# Altium project MOTOR_DRIVE_EVAL.PrjPCB (part 1 of 2)
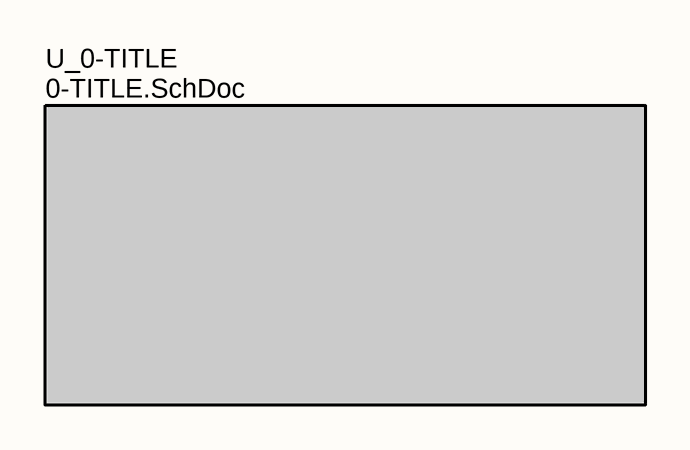
[diagram p0: 1-MAIN.SchDoc]
14 sheets, 148 parts. Net scope: flat (ports and power ports of the same name join across sheets).
Board file: MD_EVAL_BRD.PcbDoc
Sheets:
  1-MAIN.SchDoc
    U_0-TITLE = 0-TITLE.SchDoc
  2-BUCK_3V3_MCU.SchDoc
  3-MCU.SchDoc
  4-JTAG.SchDoc
  5-CAN_TRANSCEIVER.SchDoc
  6-INTERCONNECT_MAP.SchDoc
  7-PWM_INTERLOCK.SchDoc
  8-DRV_LDO_6V.SchDoc
  9-SIGNAL_CONDITIONING.SchDoc
  10-BUS_SENS.SchDoc
  11-HALF_BRIDGE.SchDoc
  12-TEMPERATURE.SchDoc
  13-MECHANICALS.SchDoc

## Sheet 1-MAIN.SchDoc: MAIN
size A0; Author: Alexandre Cosneau; CompanyName: Tristar Multicopters; DrawnBy: Alexandre Cosneau; Engineer: Alexandre Cosneau; Organization: Tristar Multicopters; Address1: Genie / GEGI; Address2: 2500 boulevard de l'universite; Address3: J1K2R SHERBROOKE; Address4: QUEBEC, CANADA; DocumentNumber: 2; Revision: 1.0; SheetNumber: 2; SheetTotal: 15

### Sub-sheets
U_0-TITLE = 0-TITLE.SchDoc: no entries

### Notes on the sheet
- Title
- Size:
- Date:
- File:
- A0
- Number:
- Time:
- Revision:
- Sheet
- of

## Sheet 0-TITLE.SchDoc: ESC GaN V1
size B; Author: Alexandre Cosneau; CompanyName: Tristar Multicopters; DrawnBy: Alexandre Cosneau; Organization: Tristar Multicopters; Address1: Genie / GEGI; Address2: 2500 boulevard de l'universite; Address3: J1K2R SHERBROOKE; Address4: QUEBEC, CANADA; DocumentNumber: 1; Revision: 1.0; SheetNumber: 1; SheetTotal: 15

### Notes on the sheet
- REV
- COMMENT
- REVISION HISTORY
- DATE
- Title:
- Size:
- Date:
- A
- Revision:
- Time:
- Author:
- Sheet
- of
- File:

## Sheet 2-BUCK_3V3_MCU.SchDoc: BUCK 3V3 MCU
size A4; Author: Alexandre Cosneau; CompanyName: Tristar; Organization: Tristar; Address1: Suite J-1270; Address2: 400 Rue Montfort; Address3: H3C4J9, MONTREAL; Address4: QUEBEC, CANADA
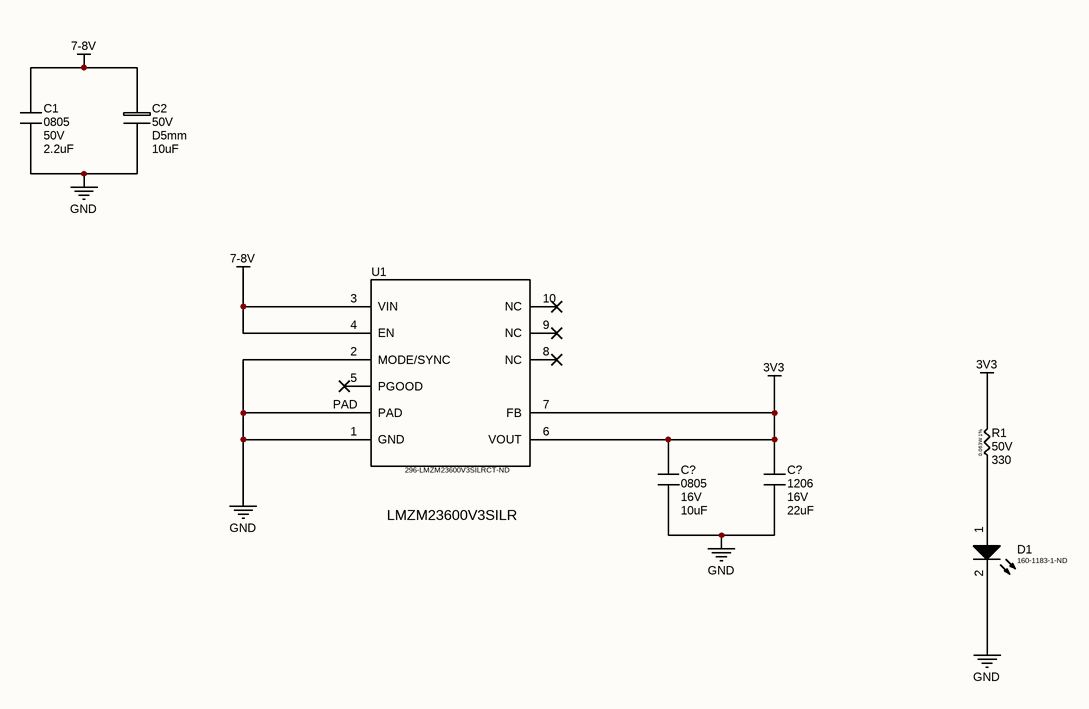
[diagram p1: 2-BUCK_3V3_MCU.SchDoc]

### Parts
(Parts that share a designator on the sheet are numbered #1, #2 ... from top to bottom, then left to right.)
C1#1  Package: 0805  VDC: 50V  [C 0805(2012)x0.65]  (hidden comment: 2.2uF)
C2#1  VDC: 50V  Package: D5mm  [EL SMD D5 h5.4]  (hidden comment: 10uF)
C?#1  Package: 0805  VDC: 16V  [C 0805(2012)x0.65]  (hidden comment: 10uF)
C?#2  Package: 1206  VDC: 16V  [C 1206(3216)x1.6]  (hidden comment: 22uF)
D1#1  Supplier Part Number 1: 160-1183-1-ND  [LED 0603]  (hidden comment: LED 0603)
R1#1  VDC: 50V  [R 0402(1005)-1%]  (hidden comment: 330)
U1#1  Supplier Part Number 1: 296-LMZM23600V3SILRCT-ND  [MICROSIP-10]  (hidden comment: MICROSIP)

### Nets
3V3: C?#1.1 C?#2.1 R1#1.2 U1#1.6(VOUT) U1#1.7(FB)
7-8V: C1#1.1 C2#1.1 U1#1.3(VIN) U1#1.4(EN)
GND: C1#1.2 C2#1.2 C?#1.2 C?#2.2 D1#1.2 U1#1.1(GND) U1#1.2(MODE/SYNC) U1#1.PAD
NetD1#1_1: D1#1.1 R1#1.1

Not connected (* = marked no-connect by the designer): U1#1 5(PGOOD)* 8(NC)* 9(NC)* 10(NC)*

### Notes on the sheet
- LMZM23600V3SILR
- Title:
- Size:
- Date:
- A
- Revision:
- Time:
- Author:
- Sheet
- of
- File:
- (in symbol RES 0402-1%) 0.063W 1%

### Library data of the parts
C1#1 C?#1 = CAP 0805 2.2nF 50V X7R: SMD-0805 50V X7R 10%; Part Number: CL21B222KBNC; Manufacturer: Samsung; TYPE: Capacitors; Package-mm: 2012; Mount Type: SMT; Publisher: Hefest; Manufacturer Alternate: *; Part Number Alternate: *; Published: 07.04.2019; Supplier 1: Comet; Supplier 2: *; Supplier 3: *; Supplier Part Number 1: C0805 2.2nF 50V X7R SAMSUNG; Supplier Part Number 2: *; Supplier Part Number 3: *; RoHS: Y; Technology: Ceramic  MLCC; Value 1: *; Value 2: *; TempCo: X7R; Tolerance %: ±10%; VAC: *; ESR Ohm: *; ComponentLink1Description: Datasheet link; ComponentLink1URL: https://store.comet.bg/download-file.php?id=11; Temperature Range: -55°C ~ +125°C; Price: 0.026
  C1#1: Value: 2.2uF
  C?#1: Value: 10uF
C2#1 = EL 10uF 50V +105°C: SMD D5mm h5.4mm; Part Number: CK1H100M-CRE54; Manufacturer: Fujicon; Tolerance %: ±20%; TYPE: Capacitors; Load life: 2000h @ +105°C; Mount Type: SMT; Publisher: Hefest; Manufacturer Alternate: *; Part Number Alternate: *; Published: 07.04.2019; Supplier 1: Comet; Supplier 2: *; Supplier 3: *; Supplier Part Number 1: CE 10uF 50V SMD 105C Fujicon; Supplier Part Number 2: *; Supplier Part Number 3: *; RoHS: Y; Technology: Electrolytic Aluminum; Value 1: *; Value 2: *; TempCo: *; VAC: *; ESR Ohm: *; ComponentLink1Description: Datasheet link; ComponentLink1URL: https://store.comet.bg/download-file.php?id=10100; Temperature Range: -40°C ~ +105°C; Price: 0.106; Value: 10uF
C?#2 = CAP 1206 4.7uF 50V X7R: SMD-1206 50V X7R 10%; Part Number: CL31B475KBHNNNE; Manufacturer: Samsung; TYPE: Capacitors; Package-mm: 3216; Mount Type: SMT; Publisher: Hefest; Manufacturer Alternate: *; Part Number Alternate: *; Published: 07.04.2019; Supplier 1: Comet; Supplier 2: *; Supplier 3: *; Supplier Part Number 1: C1206 4.7uF 50V X7R SAMSUNG; Supplier Part Number 2: *; Supplier Part Number 3: *; RoHS: Y; Technology: Ceramic  MLCC; Value 1: *; Value 2: *; TempCo: X7R; Tolerance %: ±10%; VAC: *; ESR Ohm: *; ComponentLink1Description: Datasheet link; ComponentLink1URL: https://store.comet.bg/download-file.php?id=11; Temperature Range: -55°C ~ +125°C; Price: 0.290; Value: 22uF
D1#1 = LED 0603: LED SMD 0603; Supplier 1: Digi-Key; PACKAGE: 0603; TYPE: LED
R1#1 = RES 0402-1%: SMD 0402 0.063W 1% 50V; Manufacturer: YAGEO; TempCo: ±100ppm/°C; Package-mm: 1005; Value Code: 1001; Power: 0.0625W; Part Number: *; Mount Type: SMT; Publisher: Hefest; Manufacturer Alternate: *; Published: 07.04.2019; Supplier 1: Comet; Supplier 2: *; Supplier 3: *; Supplier Part Number 1: R0402 1.0K 1% YAG/ASJ; Supplier Part Number 2: *; Supplier Part Number 3: *; RoHS: Y; Technology: Thick film; Value 2: *; Package: 0402; Tolerance %: ±1%; ComponentLink1Description: Datasheet link; ComponentLink1URL: https://store.comet.bg/download-file.php?id=1224; Temperature Range: -55°C ~ +155°C; Price: 0.015; Part Number Alternate: *; TYPE: Resistor; Value 1: *; Value: 330
U1#1 = LMZM23600: V3 DCDC 3V3 500mA; Supplier 1: Digi-Key; PACKAGE: MICROSIP; TYPE: BUCK

## Sheet 3-MCU.SchDoc: MCU
size A1; CompanyName: TRISTAR; Organization: Sherbrooke's University; Address1: Genie / GEGI; Address2: 2500 boulevard de l'universite; Address3: J1K2R SHERBROOKE; Address4: QUEBEC, CANADA
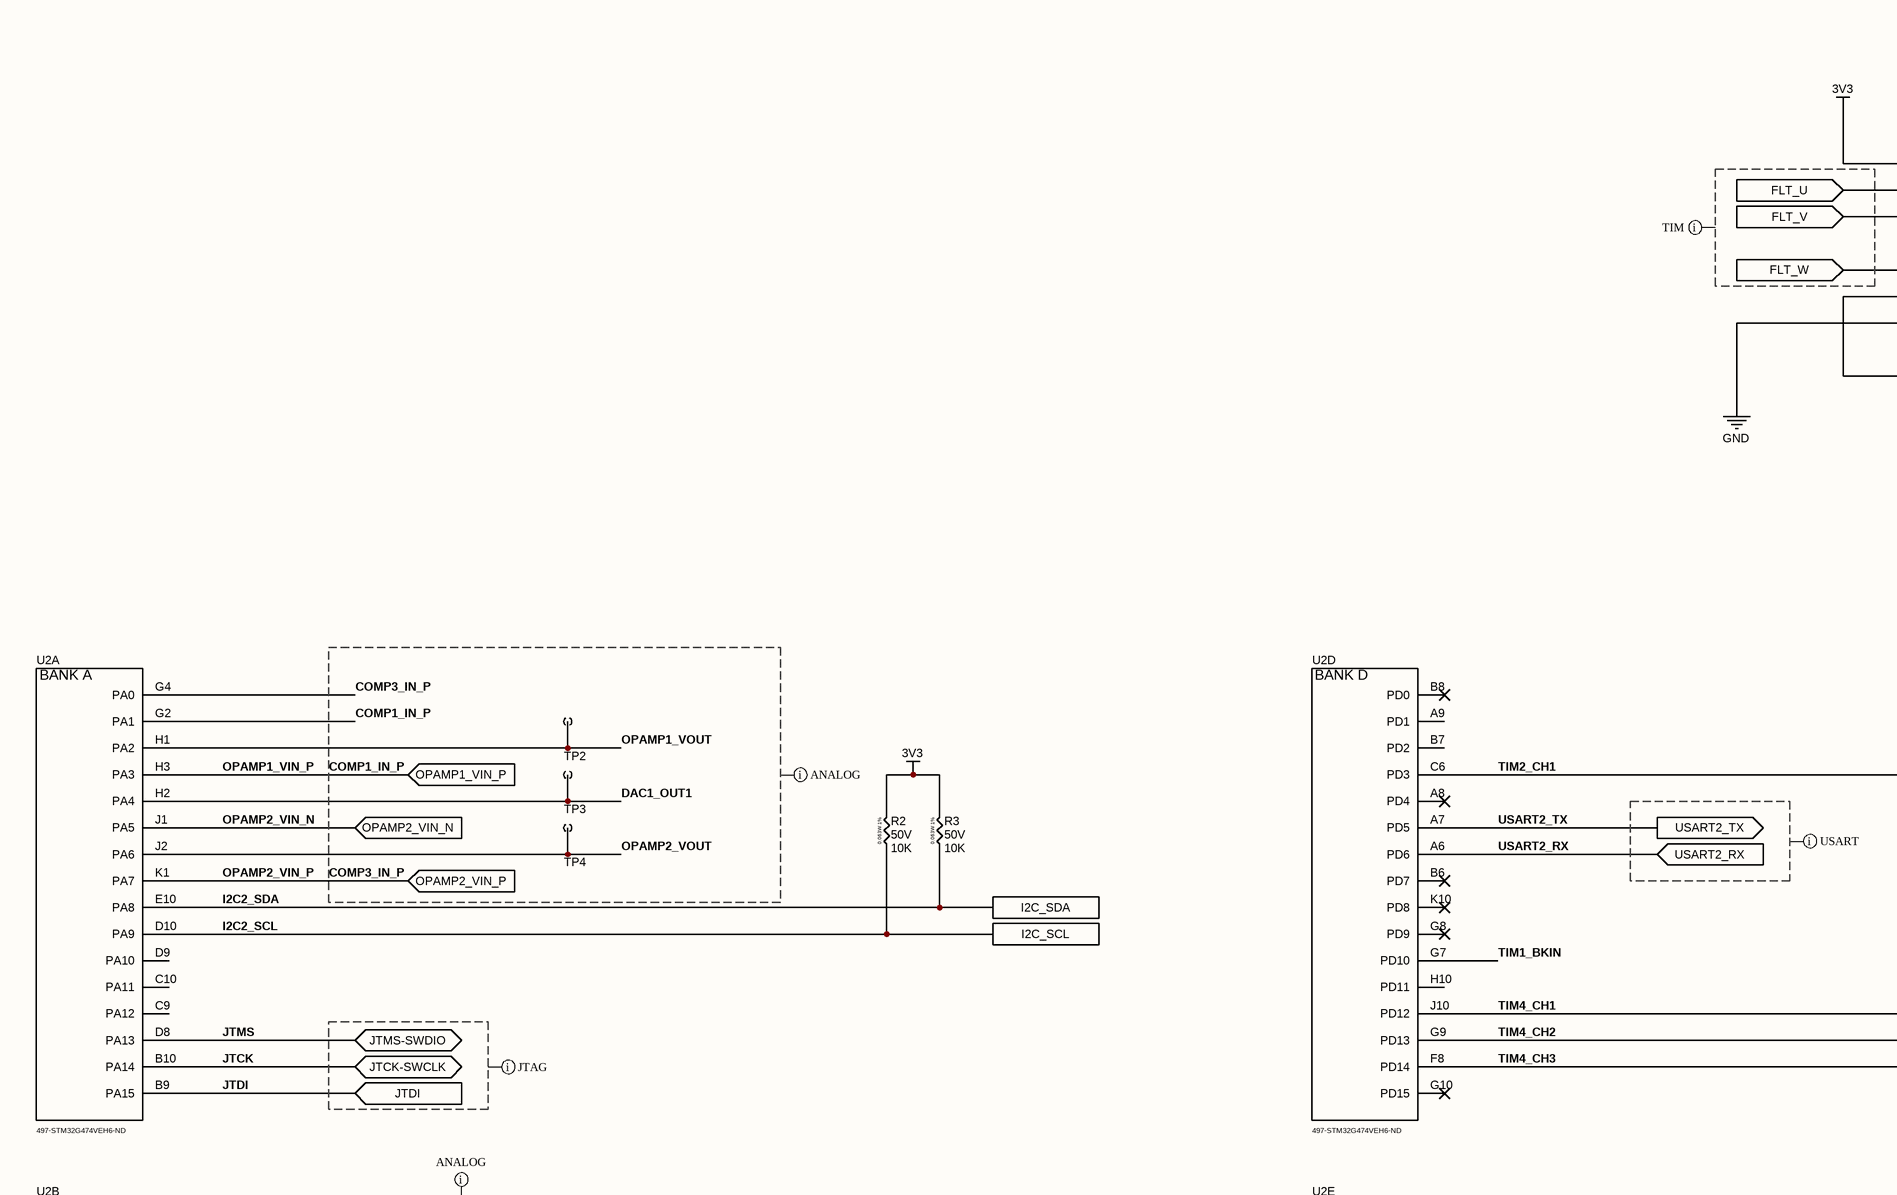
[diagram p2: 3-MCU.SchDoc, top left]
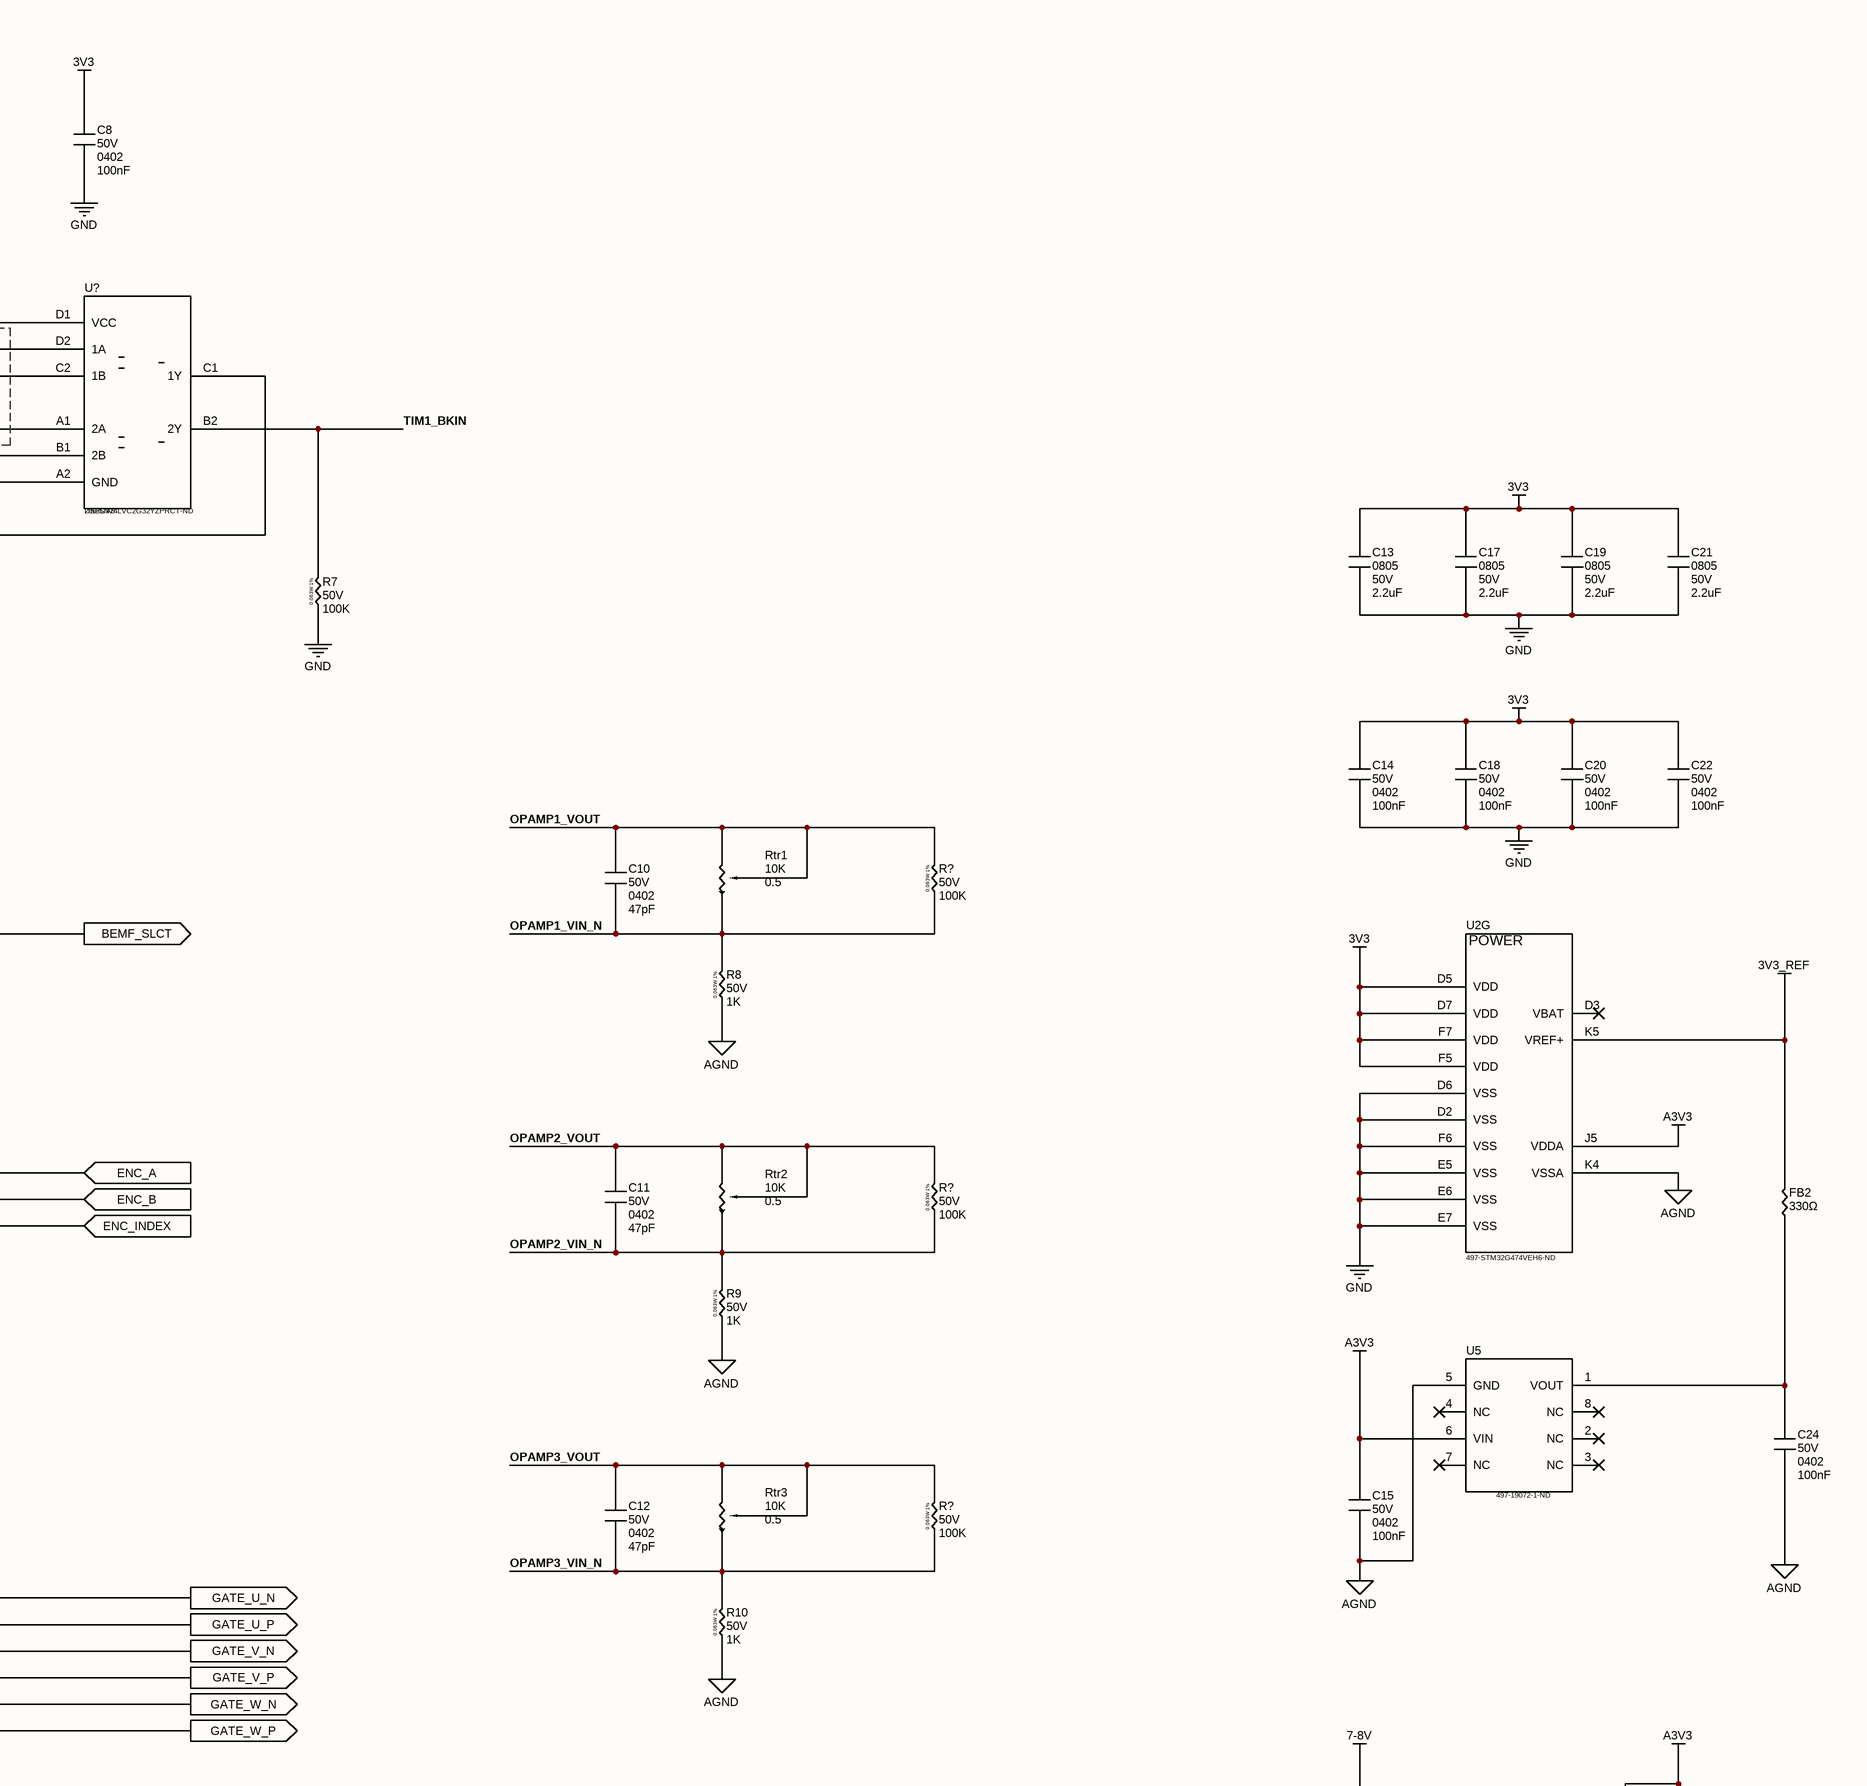
[diagram p3: 3-MCU.SchDoc, top right]
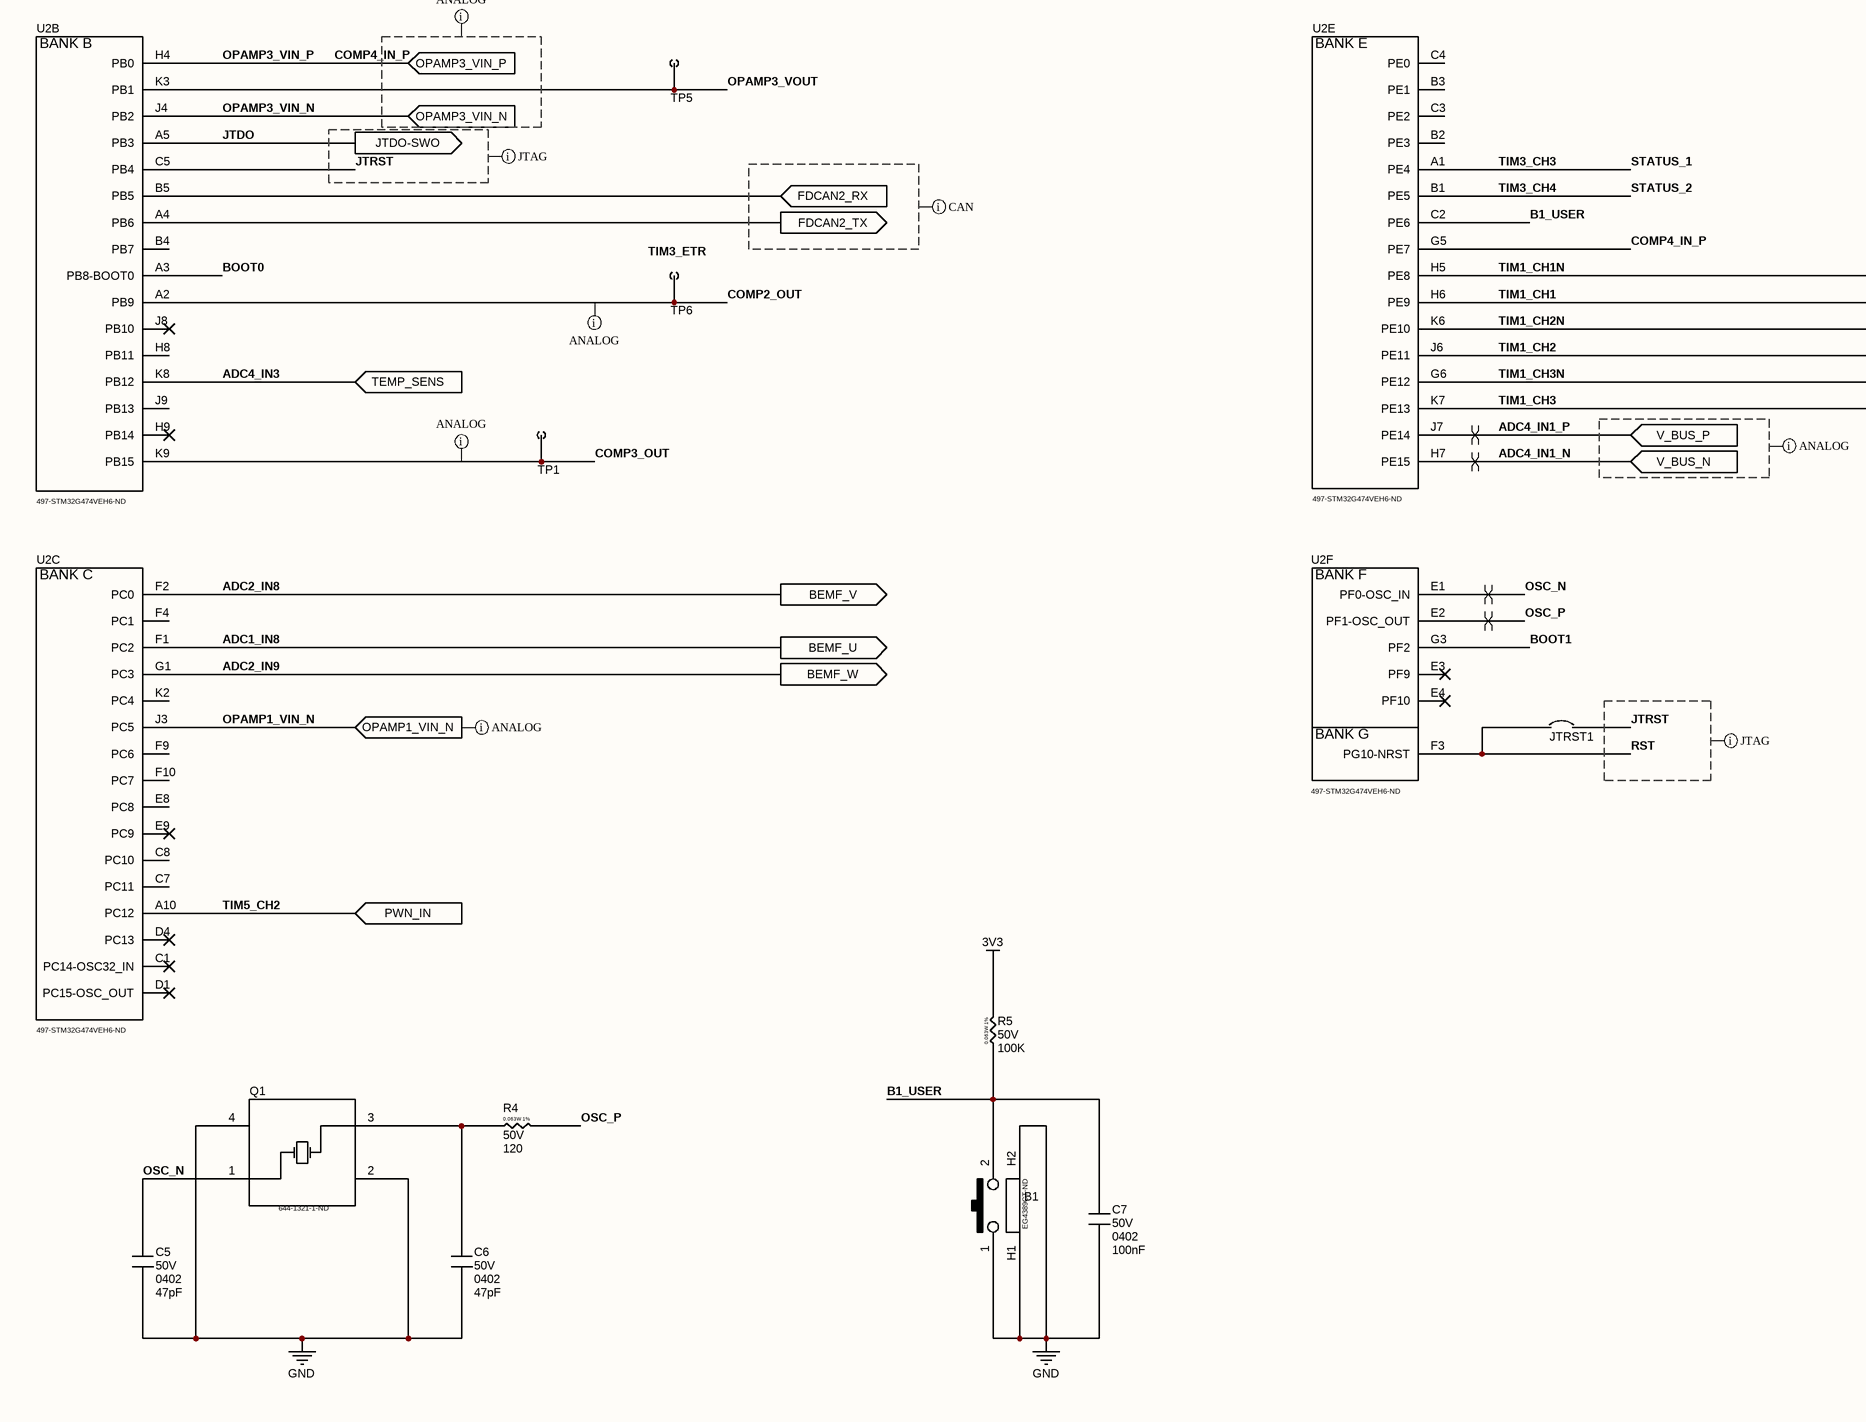
[diagram p4: 3-MCU.SchDoc, bottom left]
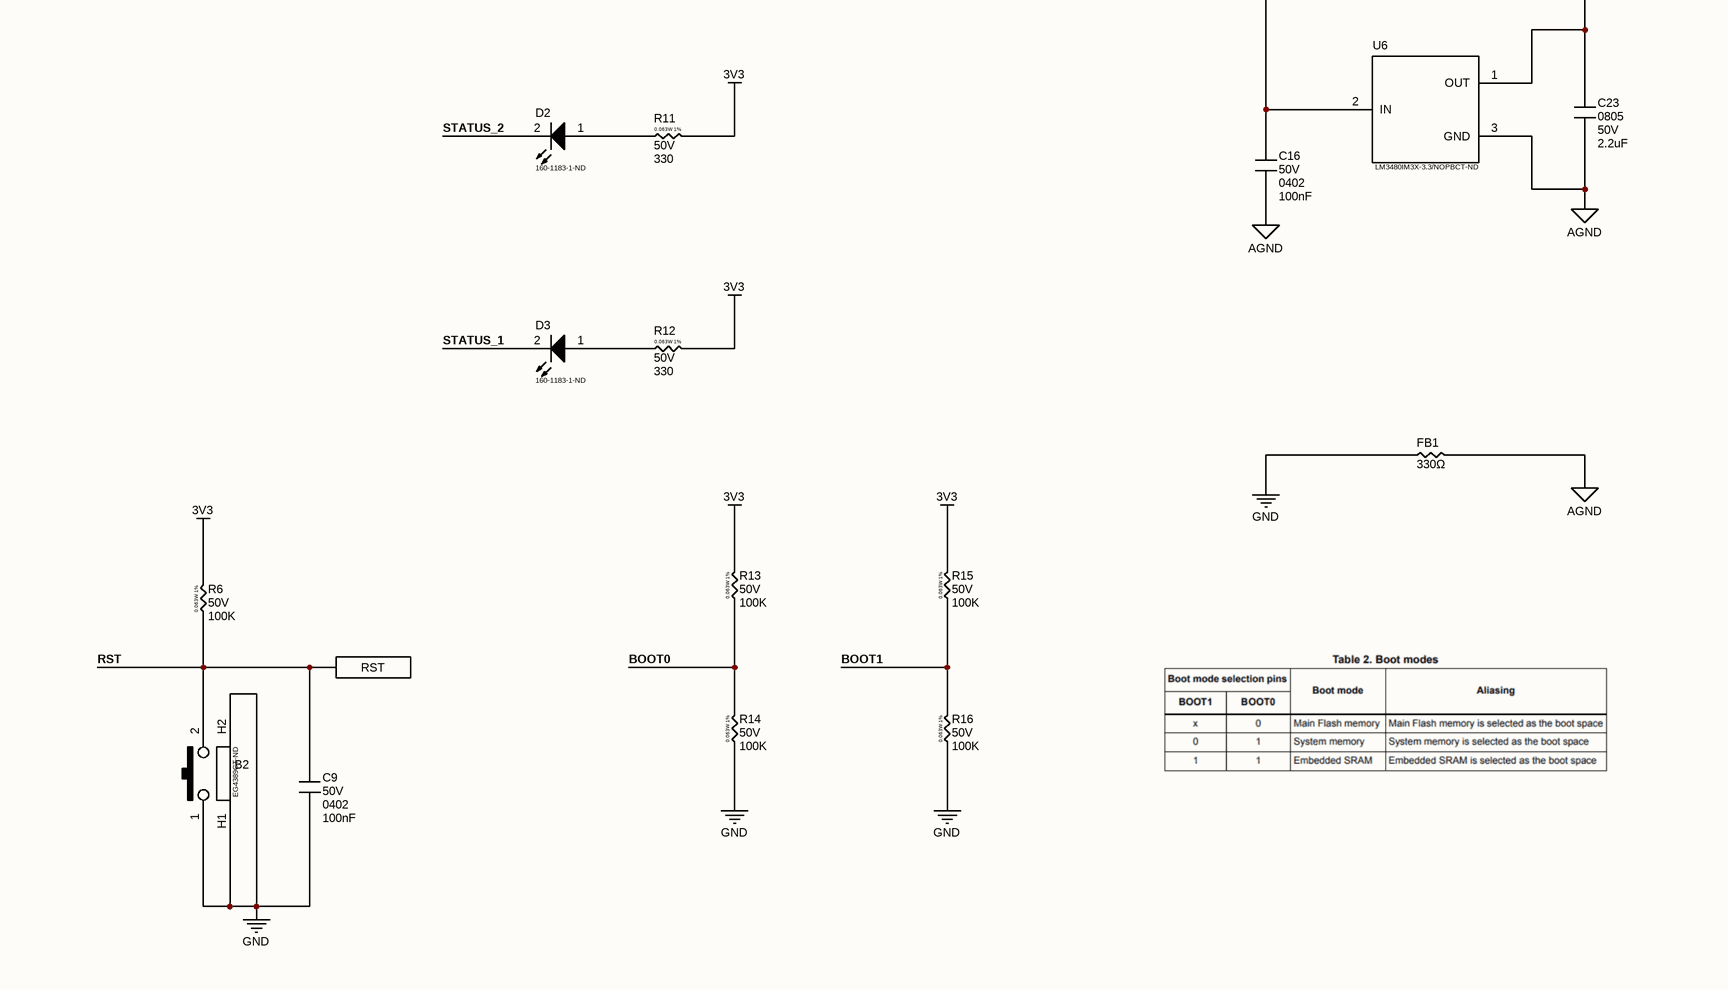
[diagram p5: 3-MCU.SchDoc, bottom right]

### Parts
(Parts that share a designator on the sheet are numbered #1, #2 ... from top to bottom, then left to right.)
B1  Supplier Part Number 1: EG4389CT-ND  [BUTTON_SINGLE_SIDE]  (hidden comment: PUSH BUTT SINGLE SIDE)
B2  Supplier Part Number 1: EG4389CT-ND  [BUTTON_SINGLE_SIDE]  (hidden comment: PUSH BUTT SINGLE SIDE)
C5  VDC: 50V  Package: 0402  [C 0402(1005)x0.5]  (hidden comment: 47pF)
C6  VDC: 50V  Package: 0402  [C 0402(1005)x0.5]  (hidden comment: 47pF)
C7  VDC: 50V  Package: 0402  [C 0402(1005)x0.5]  (hidden comment: 100nF)
C8  VDC: 50V  Package: 0402  [C 0402(1005)x0.5]  (hidden comment: 100nF)
C9  VDC: 50V  Package: 0402  [C 0402(1005)x0.5]  (hidden comment: 100nF)
C10  VDC: 50V  Package: 0402  [C 0402(1005)x0.5]  (hidden comment: 47pF)
C11#1  VDC: 50V  Package: 0402  [C 0402(1005)x0.5]  (hidden comment: 47pF)
C12#1  VDC: 50V  Package: 0402  [C 0402(1005)x0.5]  (hidden comment: 47pF)
C13#1  Package: 0805  VDC: 50V  [C 0805(2012)x0.65]  (hidden comment: 2.2uF)
C14#1  VDC: 50V  Package: 0402  [C 0402(1005)x0.5]  (hidden comment: 100nF)
C15#1  VDC: 50V  Package: 0402  [C 0402(1005)x0.5]  (hidden comment: 100nF)
C16#1  VDC: 50V  Package: 0402  [C 0402(1005)x0.5]  (hidden comment: 100nF)
C17#1  Package: 0805  VDC: 50V  [C 0805(2012)x0.65]  (hidden comment: 2.2uF)
C18#1  VDC: 50V  Package: 0402  [C 0402(1005)x0.5]  (hidden comment: 100nF)
C19  Package: 0805  VDC: 50V  [C 0805(2012)x0.65]  (hidden comment: 2.2uF)
C20  VDC: 50V  Package: 0402  [C 0402(1005)x0.5]  (hidden comment: 100nF)
C21  Package: 0805  VDC: 50V  [C 0805(2012)x0.65]  (hidden comment: 2.2uF)
C22  VDC: 50V  Package: 0402  [C 0402(1005)x0.5]  (hidden comment: 100nF)
C23#1  Package: 0805  VDC: 50V  [C 0805(2012)x0.65]  (hidden comment: 2.2uF)
C24  VDC: 50V  Package: 0402  [C 0402(1005)x0.5]  (hidden comment: 100nF)
D2#1  Supplier Part Number 1: 160-1183-1-ND  [LED 0603]  (hidden comment: LED 0603)
D3#1  Supplier Part Number 1: 160-1183-1-ND  [LED 0603]  (hidden comment: LED 0603)
FB1  ZTyp@100MHz: 330Ω  [FB 0805(2012)]  (hidden comment: 0.525u)
FB2  ZTyp@100MHz: 330Ω  [FB 0805(2012)]  (hidden comment: 0.525u)
JTRST1  SHORT_PARALLEL  [SHORT_PARALLEL]  (value not drawn)  (net tie, no BOM)
Q1#1  Supplier Part Number 1: 644-1321-1-ND  [QUARTZ_1]  (hidden comment: OSC NX2016)
R2#1  VDC: 50V  [R 0402(1005)-1%]  (hidden comment: 10K)
R3#1  VDC: 50V  [R 0402(1005)-1%]  (hidden comment: 10K)
R4#1  VDC: 50V  [R 0402(1005)-1%]  (hidden comment: 120)
R5  VDC: 50V  [R 0402(1005)-1%]  (hidden comment: 100K)
R6  VDC: 50V  [R 0402(1005)-1%]  (hidden comment: 100K)
R7  VDC: 50V  [R 0402(1005)-1%]  (hidden comment: 100K)
R8  VDC: 50V  [R 0402(1005)-1%]  (hidden comment: 1K)
R9  VDC: 50V  [R 0402(1005)-1%]  (hidden comment: 1K)
R10  VDC: 50V  [R 0402(1005)-1%]  (hidden comment: 1K)
R11#1  VDC: 50V  [R 0402(1005)-1%]  (hidden comment: 330)
R12#1  VDC: 50V  [R 0402(1005)-1%]  (hidden comment: 330)
R13#1  VDC: 50V  [R 0402(1005)-1%]  (hidden comment: 100K)
R14#1  VDC: 50V  [R 0402(1005)-1%]  (hidden comment: 100K)
R15#1  VDC: 50V  [R 0402(1005)-1%]  (hidden comment: 100K)
R16#1  VDC: 50V  [R 0402(1005)-1%]  (hidden comment: 100K)
R?#1  VDC: 50V  [R 0402(1005)-1%]  (hidden comment: 100K)
R?#2  VDC: 50V  [R 0402(1005)-1%]  (hidden comment: 100K)
R?#3  VDC: 50V  [R 0402(1005)-1%]  (hidden comment: 100K)
Rtr1  Set Position: 0.5  [Rtr SMD3]  (hidden comment: 10K)
Rtr2  Set Position: 0.5  [Rtr SMD3]  (hidden comment: 10K)
Rtr3  Set Position: 0.5  [Rtr SMD3]  (hidden comment: 10K)
TP1  TP ROUND  [TP_ROUND]  (value not drawn)  (no BOM)
TP2  TP ROUND  [TP_ROUND]  (value not drawn)  (no BOM)
TP3  TP ROUND  [TP_ROUND]  (value not drawn)  (no BOM)
TP4  TP ROUND  [TP_ROUND]  (value not drawn)  (no BOM)
TP5  TP ROUND  [TP_ROUND]  (value not drawn)  (no BOM)
TP6  TP ROUND  [TP_ROUND]  (value not drawn)  (no BOM)
U2#1  Supplier Part Number 1: 497-STM32G474VEH6-ND  [TFBGA-100]  (hidden comment: STM32 TFBGA 100)  (parts A,B,C,D,E,F,G of 7)
U5  Supplier Part Number 1: 497-19072-1-ND  [QFN8_2_2]  (hidden comment: QFN8)
U6  Supplier Part Number 1: LM3480IM3X-3.3/NOPBCT-ND  [SOT23_3_0.95_1.6]  (hidden comment: SOT23)
U?#1  DSBGA8  Supplier Part Number 1: 296-SN74LVC2G32YZPRCT-ND  [DSBGA-8]

### Ports
BEMF_SLCT (out), BEMF_U (out), BEMF_V (out), BEMF_W (out), ENC_A (in), ENC_B (in), ENC_INDEX (in), FDCAN2_RX (in), FDCAN2_TX (out), FLT_U (in), FLT_V (in), FLT_W (in), GATE_U_N (out), GATE_U_P (out), GATE_V_N (out), GATE_V_P (out), GATE_W_N (out), GATE_W_P (out), I2C_SCL, I2C_SDA, JTCK-SWCLK (bidir), JTDI (in), JTDO-SWO (out), JTMS-SWDIO (bidir), OPAMP1_VIN_N (in), OPAMP1_VIN_P (in), OPAMP2_VIN_N (in), OPAMP2_VIN_P (in), OPAMP3_VIN_N (in), OPAMP3_VIN_P (in), PWN_IN (in), RST, TEMP_SENS (in), USART2_RX (in), USART2_TX (out), V_BUS_N (in), V_BUS_P (in)

### Nets
3V3: C8.1 C13#1.1 C14#1.1 C17#1.1 C18#1.1 C19.1 C20.1 C21.1 C22.1 R2#1.2 R3#1.2 R5.2 R6.2 R11#1.2 R12#1.2 R13#1.2 R15#1.2 U2#1.D5(VDD) U2#1.D7(VDD) U2#1.F5(VDD) U2#1.F7(VDD) U?#1.D1(VCC)
3V3_REF: FB2.2 U2#1.K5(VREF+)
7-8V: C16#1.1 U6.2(IN)
A3V3: C15#1.1 C23#1.1 U2#1.J5(VDDA) U5.6(VIN) U6.1(OUT)
AGND: C15#1.2 C16#1.2 C23#1.2 C24.2 FB1.2 R8.1 R9.1 R10.1 U2#1.K4(VSSA) U5.5(GND) U6.3(GND)
GND: B1.1 B1.H1 B1.H2 B2.1 B2.H1 B2.H2 C5.2 C6.2 C7.2 C8.2 C9.2 C13#1.2 C14#1.2 C17#1.2 C18#1.2 C19.2 C20.2 C21.2 C22.2 FB1.1 Q1#1.2 Q1#1.4(GND) R7.1 R14#1.1 R16#1.1 U2#1.D2(VSS) U2#1.D6(VSS) U2#1.E5(VSS) U2#1.E6(VSS) U2#1.E7(VSS) U2#1.F6(VSS) U?#1.A2(GND)
ADC1_IN8: U2#1.F1(PC2) ; port BEMF_U
ADC2_IN8: U2#1.F2(PC0) ; port BEMF_V
ADC2_IN9: U2#1.G1(PC3) ; port BEMF_W
ADC4_IN1_N: U2#1.H7(PE15) ; port V_BUS_N
ADC4_IN1_P: U2#1.J7(PE14) ; port V_BUS_P
ADC4_IN3: U2#1.K8(PB12) ; port TEMP_SENS
B1_USER: B1.2 C7.1 R5.1 U2#1.C2(PE6)
BOOT0: R13#1.1 R14#1.2 U2#1.A3(PB8-BOOT0)
BOOT1: R15#1.1 R16#1.2 U2#1.G3(PF2)
COMP1_IN_P: U2#1.G2(PA1) U2#1.H3(PA3) ; port OPAMP1_VIN_P  [also labelled OPAMP1_VIN_P]
COMP2_OUT: TP6.1 U2#1.A2(PB9)
COMP3_IN_P: U2#1.G4(PA0) U2#1.K1(PA7) ; port OPAMP2_VIN_P  [also labelled OPAMP2_VIN_P]
COMP3_OUT: TP1.1 U2#1.K9(PB15)
COMP4_IN_P: U2#1.G5(PE7) U2#1.H4(PB0) ; port OPAMP3_VIN_P  [also labelled OPAMP3_VIN_P]
DAC1_OUT1: TP3.1 U2#1.H2(PA4)
I2C2_SCL: R2#1.1 U2#1.D10(PA9) ; port I2C_SCL
I2C2_SDA: R3#1.1 U2#1.E10(PA8) ; port I2C_SDA
JTCK: U2#1.B10(PA14) ; port JTCK-SWCLK
JTDI: U2#1.B9(PA15) ; port JTDI
JTDO: U2#1.A5(PB3) ; port JTDO-SWO
JTMS: U2#1.D8(PA13) ; port JTMS-SWDIO
JTRST: JTRST1.2 U2#1.C5(PB4)
OPAMP1_VIN_N: C10.2 R8.2 R?#1.1 Rtr1.1 U2#1.J3(PC5) ; port OPAMP1_VIN_N
OPAMP1_VOUT: C10.1 R?#1.2 Rtr1.2 Rtr1.3 TP2.1 U2#1.H1(PA2)
OPAMP2_VIN_N: C11#1.2 R9.2 R?#2.1 Rtr2.1 U2#1.J1(PA5) ; port OPAMP2_VIN_N
OPAMP2_VOUT: C11#1.1 R?#2.2 Rtr2.2 Rtr2.3 TP4.1 U2#1.J2(PA6)
OPAMP3_VIN_N: C12#1.2 R10.2 R?#3.1 Rtr3.1 U2#1.J4(PB2) ; port OPAMP3_VIN_N
OPAMP3_VOUT: C12#1.1 R?#3.2 Rtr3.2 Rtr3.3 TP5.1 U2#1.K3(PB1)
OSC_N: C5.1 Q1#1.1 U2#1.E1(PF0-OSC_IN)
OSC_P: R4#1.2 U2#1.E2(PF1-OSC_OUT)
RST: B2.2 C9.1 JTRST1.1 R6.1 U2#1.F3(PG10-NRST) ; port RST
STATUS_1: D3#1.2 U2#1.A1(PE4)  [also labelled TIM3_CH3]
STATUS_2: D2#1.2 U2#1.B1(PE5)  [also labelled TIM3_CH4]
TIM1_BKIN: R7.2 U2#1.G7(PD10) U?#1.B2(2Y)
TIM1_CH1: U2#1.H6(PE9) ; port GATE_U_P
TIM1_CH1N: U2#1.H5(PE8) ; port GATE_U_N
TIM1_CH2: U2#1.J6(PE11) ; port GATE_V_P
TIM1_CH2N: U2#1.K6(PE10) ; port GATE_V_N
TIM1_CH3: U2#1.K7(PE13) ; port GATE_W_P
TIM1_CH3N: U2#1.G6(PE12) ; port GATE_W_N
TIM2_CH1: U2#1.C6(PD3) ; port BEMF_SLCT
TIM4_CH1: U2#1.J10(PD12) ; port ENC_A
TIM4_CH2: U2#1.G9(PD13) ; port ENC_B
TIM4_CH3: U2#1.F8(PD14) ; port ENC_INDEX
TIM5_CH2: U2#1.A10(PC12) ; port PWN_IN
USART2_RX: U2#1.A6(PD6) ; port USART2_RX
USART2_TX: U2#1.A7(PD5) ; port USART2_TX
NetC6_1: C6.1 Q1#1.3(OSC2) R4#1.1
NetC24_1: C24.1 FB2.1 U5.1(VOUT)
NetD2#1_1: D2#1.1 R11#1.1
NetD3#1_1: D3#1.1 R12#1.1
NetU2#1_A4: U2#1.A4(PB6) ; port FDCAN2_TX
NetU2#1_B5: U2#1.B5(PB5) ; port FDCAN2_RX
NetU?#1_A1: U?#1.A1(2A) ; port FLT_W
NetU?#1_B1: U?#1.B1(2B) U?#1.C1(1Y)
NetU?#1_C2: U?#1.C2(1B) ; port FLT_V
NetU?#1_D2: U?#1.D2(1A) ; port FLT_U

Not connected (* = marked no-connect by the designer): U2#1 A8(PD4)* A9(PD1) B2(PE3) B3(PE1) B4(PB7) B6(PD7)* B7(PD2) B8(PD0)* C1(PC14-OSC32_IN)* C3(PE2) C4(PE0) C7(PC11) C8(PC10) C9(PA12) C10(PA11) D1(PC15-OSC_OUT)* D3(VBAT)* D4(PC13)* D9(PA10) E3(PF9)* E4(PF10)* E8(PC8) E9(PC9)* F4(PC1) F9(PC6) F10(PC7) G8(PD9)* G10(PD15)* H8(PB11) H9(PB14)* H10(PD11) J8(PB10)* J9(PB13) K2(PC4) K10(PD8)*; U5 2(NC)* 3(NC)* 4(NC)* 7(NC)* 8(NC)*

### Layout directives
differential pair: ADC4_IN1_N, ADC4_IN1_P, OSC_N, OSC_P
net class JTAG: (no net found under the mark), JTRST, RST
net class USART: (no net found under the mark)
net class CAN_BUS: (no net found under the mark)
net class ANALOG: (no net found under the mark), COMP1_IN_P, COMP2_OUT, COMP3_IN_P, COMP3_OUT, DAC1_OUT1, OPAMP1_VIN_N, OPAMP1_VOUT, OPAMP2_VOUT
net class TIM: (no net found under the mark)

### Notes on the sheet
- Labels drawn without touching a wire or pin: TIM3_ETR
- Size:
- Title:
- E
- Revision:
- Author:
- Date:
- File:
- Time:
- Sheet
- of
- (in symbol RES 0402-1%) 0.063W 1%
- (in symbol STM32G474VEH6, part A) BANK A
- (in symbol STM32G474VEH6, part B) BANK B
- (in symbol STM32G474VEH6, part C) BANK C
- (in symbol STM32G474VEH6, part D) BANK D
- (in symbol STM32G474VEH6, part E) BANK E
- (in symbol STM32G474VEH6, part F) BANK F; BANK G
- (in symbol STM32G474VEH6, part G) POWER

### Library data of the parts
B1 B2 = PUSH BUTT SINGLE SIDE: BUTTON SINGLE SIDE SMD; Supplier 1: Digi-Key
C5-C10 C11#1 C12#1 C14#1 C15#1 C16#1 C18#1 C20 C22 C24 = CAP 0402 100nF 50V X7R: SMD-0402 100nF 50V X7R 10%; Part Number: CL05B104KB5NNNC; Manufacturer: Samsung; TYPE: Capacitors; Package-mm: 1005; Mount Type: SMT; Publisher: Hefest; Manufacturer Alternate: *; Part Number Alternate: *; Published: 07.04.2019; Supplier 1: Comet; Supplier 2: *; Supplier 3: *; Supplier Part Number 1: C0402 100nF 50V X7R; Supplier Part Number 2: *; Supplier Part Number 3: *; RoHS: Y; Technology: Ceramic  MLCC; Value 1: *; Value 2: *; TempCo: X7R; Tolerance %: ±10%; VAC: *; ESR Ohm: *; ComponentLink1Description: Datasheet link; ComponentLink1URL: https://store.comet.bg/download-file.php?id=11; Temperature Range: -55°C ~ +125°C; Price: 0.039
  C5 C6 C10 C11#1 C12#1: Value: 47pF
  C7-C9 C14#1 C15#1 C16#1 C18#1 C20 C22 C24: Value: 100nF
C13#1 C17#1 C19 C21 C23#1 = CAP 0805 2.2nF 50V X7R: as C1#1 on sheet 2-BUCK_3V3_MCU; Mount Type: SMT; Publisher: Hefest; Manufacturer Alternate: *; Part Number Alternate: *; Published: 07.04.2019; Supplier 1: Comet; Supplier 2: *; Supplier 3: *; Supplier Part Number 1: C0805 2.2nF 50V X7R SAMSUNG; Supplier Part Number 2: *; Supplier Part Number 3: *; RoHS: Y; Technology: Ceramic  MLCC; Value 1: *; Value 2: *; TempCo: X7R; Tolerance %: ±10%; VAC: *; ESR Ohm: *; ComponentLink1Description: Datasheet link; ComponentLink1URL: https://store.comet.bg/download-file.php?id=11; Temperature Range: -55°C ~ +125°C; Price: 0.026; Value: 2.2uF
D2#1 D3#1 = LED 0603: LED SMD 0603; Supplier 1: Digi-Key; PACKAGE: 0603; TYPE: LED
FB1 FB2 = FB BLM21P: SMD 0805 1.5A 330Ω/90mΩ; Part Number: BLM21PG331SN1D; Manufacturer: Murata; TYPE: Ferrite Bead; Ind: 0.525uH; DCR: 90mΩ; Material: Ferrite; Package-mm: 2012; Tolerance %: ±20%; Temperature Range: -55°C ~ +125°C; Imax: 1.5A; Irms: *; Isat: *; Value1: 90mΩ; Value2: 1.5A; Technology: Chip; Published: 07.04.2019; Publisher: Hefest; Mount Type: SMT; Package: 0805; ComponentLink1Description: Datasheet link; ComponentLink1URL: https://store.comet.bg/download-file.php?id=1453; RoHS: Y; Ztyp@1GHz: *; Manufacturer Alternate: *; Supplier 1: Comet; Supplier Part Number 1: BLM21PG331SN1D; Supplier 2: *; Supplier Part Number 2: *; Supplier 3: *; Supplier Part Number 3: *; Part Number Alternate: *; Price: 0.032; Value: 0.525u
JTRST1 = SHORT_PARALLEL: SHORTABLE PARALLEL PCB LINK
Q1#1 = OSC NX2016: OSC NX2016 24MHz; Supplier 2: Digi-Key; Supplier 1: Digi-Key
R2#1 R3#1 R4#1 R5-R10 R11#1 R12#1 R13#1 R14#1 R15#1 R16#1 R?#1-R?#3 = RES 0402-1%: as R1#1 on sheet 2-BUCK_3V3_MCU; Part Number: *; Mount Type: SMT; Publisher: Hefest; Manufacturer Alternate: *; Published: 07.04.2019; Supplier 1: Comet; Supplier 2: *; Supplier 3: *; Supplier Part Number 1: R0402 1.0K 1% YAG/ASJ; Supplier Part Number 2: *; Supplier Part Number 3: *; RoHS: Y; Technology: Thick film; Value 2: *; Package: 0402; Tolerance %: ±1%; ComponentLink1Description: Datasheet link; ComponentLink1URL: https://store.comet.bg/download-file.php?id=1224; Temperature Range: -55°C ~ +155°C; Price: 0.015; Part Number Alternate: *; TYPE: Resistor; Value 1: *
  R2#1 R3#1: Value: 10K
  R4#1: Value: 120
  R5-R7 R13#1 R14#1 R15#1 R16#1 R?#1-R?#3: Value: 100K
  R8-R10: Value: 1K
  R11#1 R12#1: Value: 330
Rtr1-Rtr3 = RES Trim TC33X-2: SMD Trimpot 3mm 0.1W 25%; Part Number: TC33X-2-102E; Manufacturer: Bourns; TempCo: ±250ppm/°C; Tolerance %: ±5%; Package-mm: 3.0x3.8x1.2mm; Value Code: 102; Rotational Cycling: 20; Mount Type: SMT; Publisher: Hefest; Manufacturer Alternate: *; Published: 07.04.2019; Supplier 1: Comet; Supplier 2: *; Supplier 3: *; Supplier Part Number 1: TC33X-2 1K; Supplier Part Number 2: *; Supplier Part Number 3: *; RoHS: Y; Technology: Thick film; Value 2: *; Package: 3mm; VDC: *; ComponentLink1Description: Datasheet link; ComponentLink1URL: https://store.comet.bg/download-file.php?id=5079; Temperature Range: -40°C ~ +100°C; Price: 0.23; Part Number Alternate: *; TYPE: TrimPot; Value 1: *; Power: 0.1W; Value: 10K
U2#1 = STM32G474VEH6: TFBGA100; [Author]: Alexandre Cosneau; Parameter 1: *; Supplier 1: Digi-Key
U5 = TS33: REF VOLTAGE 3V3 -- DETROMPEUR WRONG DIRECTION; Supplier 1: Digi-Key
U6 = LM3480: LDO 3V3 VIN 35V; Supplier 1: Digi-Key; TYPE: LDO; PACKAGE: SOT23
U?#1 = SN74LVC2G32_BGA: OR DUAL; TYPE: NOR; PACKAGE 1: DSBGA8; Supplier 1: Digi-Key
TP1-TP6 = TP ROUND: TYPE: TestPoint; Technology: PCB; Value: Tp; Mount Type: SMT; Package: TestPoint; Published: 07.04.2019; Publisher: Hefest

## Sheet 4-JTAG.SchDoc: JTAG
size A4; Author: Alexandre Cosneau; CompanyName: Tristar Multicopters; DrawnBy: Alexandre Cosneau; Engineer: Alexandre Cosneau; Organization: Tristar Multicopters; Address1: Genie / GEGI; Address2: 2500 boulevard de l'universite; Address3: J1K2R SHERBROOKE; Address4: QUEBEC, CANADA; DocumentNumber: 13; Revision: 1.0; SheetNumber: 13; SheetTotal: 15
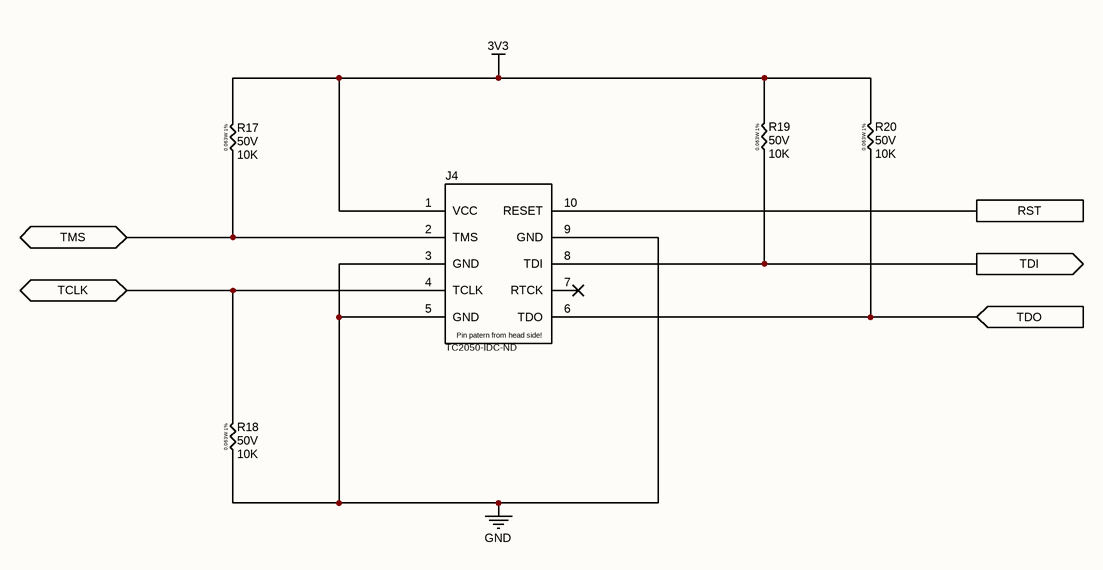
[diagram p6: 4-JTAG.SchDoc]

### Parts
(Parts that share a designator on the sheet are numbered #1, #2 ... from top to bottom, then left to right.)
J4  Supplier Part Number 1: TC2050-IDC-ND  [TC2050-IDC-FP]  (hidden comment: TC2050-IDC-FP)  (net tie, no BOM)
R17#1  VDC: 50V  [R 0402(1005)-1%]  (hidden comment: 10K)
R18#1  VDC: 50V  [R 0402(1005)-1%]  (hidden comment: 10K)
R19#1  VDC: 50V  [R 0402(1005)-1%]  (hidden comment: 10K)
R20#1  VDC: 50V  [R 0402(1005)-1%]  (hidden comment: 10K)

### Ports
RST, TCLK (bidir), TDI (out), TDO (in), TMS (bidir)

### Nets
3V3: J4.1(VCC) R17#1.2 R19#1.2 R20#1.2
GND: J4.3(GND) J4.5(GND) J4.9(GND) R18#1.1
RST: J4.10(RESET) ; port RST
NetJ4_2: J4.2(TMS) R17#1.1 ; port TMS
NetJ4_4: J4.4(TCLK) R18#1.2 ; port TCLK
NetJ4_6: J4.6(TDO) R20#1.1 ; port TDO
NetJ4_8: J4.8(TDI) R19#1.1 ; port TDI

Not connected (* = marked no-connect by the designer): J4 7(RTCK)*

### Notes on the sheet
- Title:
- Size:
- Date:
- A
- Revision:
- Time:
- Author:
- Sheet
- of
- File:
- (in symbol RES 0402-1%) 0.063W 1%
- (in symbol TC2050-IDC-FP) Pin patern from head side!

### Library data of the parts
J4 = TC2050-IDC-FP: 10 PIN JTAG PROBE; Supplier 1: Digi-Key
R17#1 R18#1 R19#1 R20#1 = RES 0402-1%: as R1#1 on sheet 2-BUCK_3V3_MCU; Part Number: *; Mount Type: SMT; Publisher: Hefest; Manufacturer Alternate: *; Published: 07.04.2019; Supplier 1: Comet; Supplier 2: *; Supplier 3: *; Supplier Part Number 1: R0402 1.0K 1% YAG/ASJ; Supplier Part Number 2: *; Supplier Part Number 3: *; RoHS: Y; Technology: Thick film; Value 2: *; Package: 0402; Tolerance %: ±1%; ComponentLink1Description: Datasheet link; ComponentLink1URL: https://store.comet.bg/download-file.php?id=1224; Temperature Range: -55°C ~ +155°C; Price: 0.015; Part Number Alternate: *; TYPE: Resistor; Value 1: *; Value: 10K

## Sheet 5-CAN_TRANSCEIVER.SchDoc: CAN TRANSCEIVER
size A4; Author: Alexandre Cosneau; CompanyName: Tristar Multicopters; DrawnBy: Alexandre Cosneau; Engineer: Alexandre Cosneau; Organization: Tristar Multicopters; Address1: Genie / GEGI; Address2: 2500 boulevard de l'universite; Address3: J1K2R SHERBROOKE; Address4: QUEBEC, CANADA; DocumentNumber: 12; Revision: 1.0; SheetNumber: 12; SheetTotal: 15
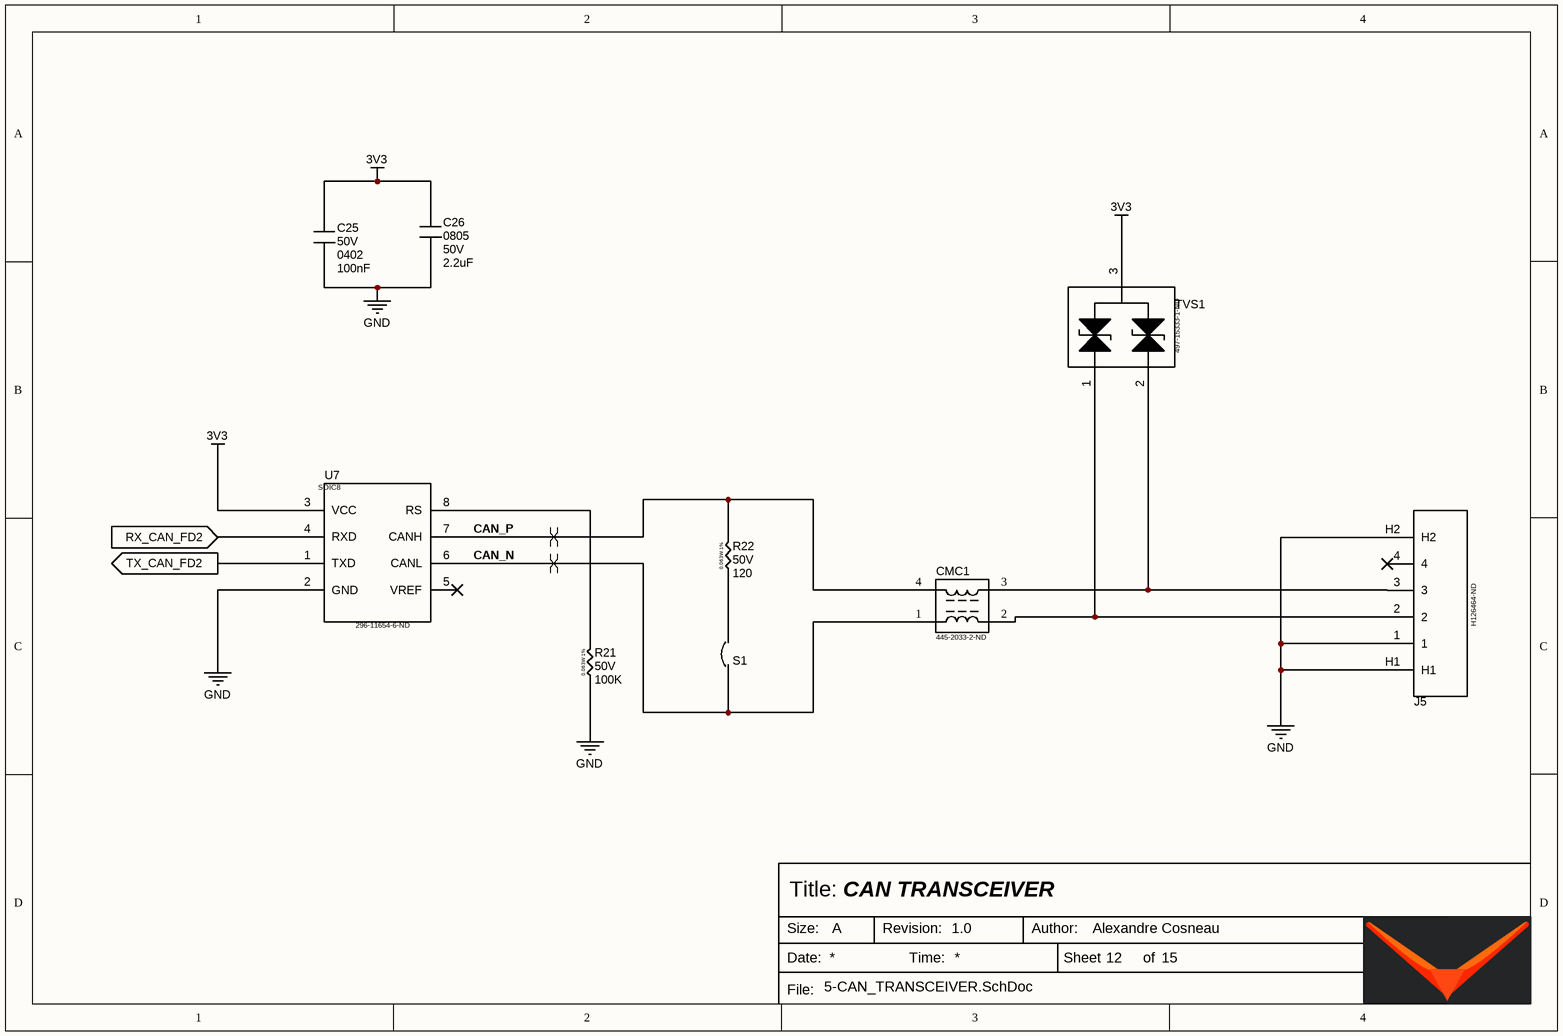
[diagram p7: 5-CAN_TRANSCEIVER.SchDoc]

### Parts
(Parts that share a designator on the sheet are numbered #1, #2 ... from top to bottom, then left to right.)
C25#1  VDC: 50V  Package: 0402  [C 0402(1005)x0.5]  (hidden comment: 100nF)
C26  Package: 0805  VDC: 50V  [C 0805(2012)x0.65]  (hidden comment: 2.2uF)
CMC1  Supplier Part Number 1: 445-2033-2-ND  [CMC_1210]  (hidden comment: TCM0403S)
J5  Supplier Part Number 1: H126464-ND  [DF13C-4P-1.25V]  (hidden comment: DF13C-4P-1.25V)
R21#1  VDC: 50V  [R 0402(1005)-1%]  (hidden comment: 100K)
R22#1  VDC: 50V  [R 0402(1005)-1%]  (hidden comment: 120)
S1  SHORT_PARALLEL  [SHORT_PARALLEL]  (value not drawn)  (net tie, no BOM)
TVS1  Supplier Part Number 1: 497-15333-1-ND  [SOT23_3_0.95_1.6]  (hidden comment: SOT23)
U7  SOIC8  Supplier Part Number 1: 296-11654-6-ND  [SOIC-8_1.27_4]

### Ports
RX_CAN_FD2 (in), TX_CAN_FD2 (out)

### Nets
3V3: C25#1.1 C26.1 TVS1.3 U7.3(VCC)
GND: C25#1.2 C26.2 J5.1 J5.H1 J5.H2 R21#1.1 U7.2(GND)
CAN_N: CMC1.1 S1.1 U7.6(CANL)
CAN_P: CMC1.4 R22#1.2 U7.7(CANH)
NetCMC1_2: CMC1.2 J5.2 TVS1.1
NetCMC1_3: CMC1.3 J5.3 TVS1.2
NetR21#1_2: R21#1.2 U7.8(RS)
NetR22#1_1: R22#1.1 S1.2
NetU7_1: U7.1(TXD) ; port TX_CAN_FD2
NetU7_4: U7.4(RXD) ; port RX_CAN_FD2

Not connected (* = marked no-connect by the designer): J5 4*; U7 5(VREF)*

### Layout directives
differential pair: CAN_N, CAN_P

### Notes on the sheet
- Title:
- Size:
- Date:
- A
- Revision:
- Time:
- Author:
- Sheet
- of
- File:
- (in symbol RES 0402-1%) 0.063W 1%

### Library data of the parts
C25#1 = CAP 0402 100nF 50V X7R: as C5 on sheet 3-MCU; Mount Type: SMT; Publisher: Hefest; Manufacturer Alternate: *; Part Number Alternate: *; Published: 07.04.2019; Supplier 1: Comet; Supplier 2: *; Supplier 3: *; Supplier Part Number 1: C0402 100nF 50V X7R; Supplier Part Number 2: *; Supplier Part Number 3: *; RoHS: Y; Technology: Ceramic  MLCC; Value 1: *; Value 2: *; TempCo: X7R; Tolerance %: ±10%; VAC: *; ESR Ohm: *; ComponentLink1Description: Datasheet link; ComponentLink1URL: https://store.comet.bg/download-file.php?id=11; Temperature Range: -55°C ~ +125°C; Price: 0.039; Value: 100nF
C26 = CAP 0805 2.2nF 50V X7R: as C1#1 on sheet 2-BUCK_3V3_MCU; Mount Type: SMT; Publisher: Hefest; Manufacturer Alternate: *; Part Number Alternate: *; Published: 07.04.2019; Supplier 1: Comet; Supplier 2: *; Supplier 3: *; Supplier Part Number 1: C0805 2.2nF 50V X7R SAMSUNG; Supplier Part Number 2: *; Supplier Part Number 3: *; RoHS: Y; Technology: Ceramic  MLCC; Value 1: *; Value 2: *; TempCo: X7R; Tolerance %: ±10%; VAC: *; ESR Ohm: *; ComponentLink1Description: Datasheet link; ComponentLink1URL: https://store.comet.bg/download-file.php?id=11; Temperature Range: -55°C ~ +125°C; Price: 0.026; Value: 2.2uF
CMC1 = TCM0403S: CMC 200mA 1K @100MHz 1210; [Author]: Alexandre Cosneau; Parameter 1: *; Supplier 1: Digi-Key
J5 = DF13C-4P-1.25V: HEADER MALE  4P 1.25 PITCH UP RIGHT; Supplier 1: Digi-Key
R21#1 R22#1 = RES 0402-1%: as R1#1 on sheet 2-BUCK_3V3_MCU; Part Number: *; Mount Type: SMT; Publisher: Hefest; Manufacturer Alternate: *; Published: 07.04.2019; Supplier 1: Comet; Supplier 2: *; Supplier 3: *; Supplier Part Number 1: R0402 1.0K 1% YAG/ASJ; Supplier Part Number 2: *; Supplier Part Number 3: *; RoHS: Y; Technology: Thick film; Value 2: *; Package: 0402; Tolerance %: ±1%; ComponentLink1Description: Datasheet link; ComponentLink1URL: https://store.comet.bg/download-file.php?id=1224; Temperature Range: -55°C ~ +155°C; Price: 0.015; Part Number Alternate: *; TYPE: Resistor; Value 1: *
  R21#1: Value: 100K
  R22#1: Value: 120
S1 = SHORT_PARALLEL: SHORTABLE PARALLEL PCB LINK
TVS1 = ESDCAN01: TVS CAN PROTECT; Supplier 1: Digi-Key; PACKAGE: SOT23; TYPE: TVS
U7 = SN65HVD230: CAN TRANSCIEVER; Supplier 1: Digi-Key

## Sheet 6-INTERCONNECT_MAP.SchDoc: SIGNAL CONDITOINING
size A3; Author: Alexandre Cosneau; CompanyName: Tristar Multicopters; DrawnBy: Alexandre Cosneau; Engineer: Alexandre Cosneau; Organization: Tristar Multicopters; Address1: Genie / GEGI; Address2: 2500 boulevard de l'universite; Address3: J1K2R SHERBROOKE; Address4: QUEBEC, CANADA; DocumentNumber: 15; Revision: 1.0; SheetNumber: 15; SheetTotal: 15
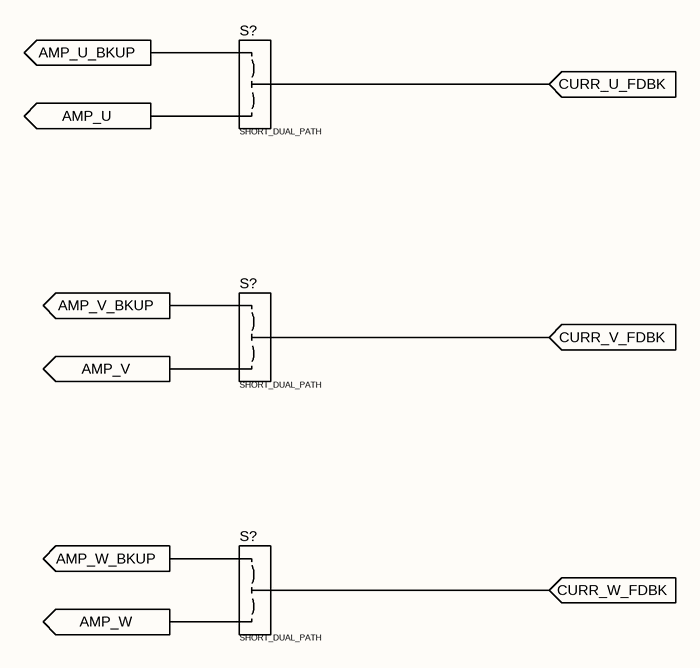
[diagram p8: 6-INTERCONNECT_MAP.SchDoc]

### Parts
(Parts that share a designator on the sheet are numbered #1, #2 ... from top to bottom, then left to right.)
S?#1  SHORT_DUAL_PATH  [SHORT_DUAL_PATH]  (net tie, no BOM)
S?#2  SHORT_DUAL_PATH  [SHORT_DUAL_PATH]  (net tie, no BOM)
S?#3  SHORT_DUAL_PATH  [SHORT_DUAL_PATH]  (net tie, no BOM)

### Ports
AMP_U (out), AMP_U_BKUP (out), AMP_V (out), AMP_V_BKUP (out), AMP_W (out), AMP_W_BKUP (out), CURR_U_FDBK (in), CURR_V_FDBK (in), CURR_W_FDBK (in)

### Nets
NetS?#1_1: S?#1.1 ; port CURR_U_FDBK
NetS?#1_2: S?#1.2 ; port AMP_U
NetS?#1_3: S?#1.3 ; port AMP_U_BKUP
NetS?#2_1: S?#2.1 ; port CURR_V_FDBK
NetS?#2_2: S?#2.2 ; port AMP_V
NetS?#2_3: S?#2.3 ; port AMP_V_BKUP
NetS?#3_1: S?#3.1 ; port CURR_W_FDBK
NetS?#3_2: S?#3.2 ; port AMP_W
NetS?#3_3: S?#3.3 ; port AMP_W_BKUP

### Notes on the sheet
- Title:
- Size:
- Date:
- File:
- E
- Revision:
- Time:
- Author:
- Sheet
- of

### Library data of the parts
S?#1-S?#3 = SHORT_DUAL_PATH: SHORTABLE PARALLEL DUAL PATH LINK

## Sheet 7-PWM_INTERLOCK.SchDoc: PWM INTERLOCK
size C; Author: A.COSNEAU; CompanyName: e-TESC LAB; DrawnBy: A.COSNEAU; Engineer: A.COSNEAU; Organization: e-TESC; Address1: Genie / GEGI; Address2: 2500 boulevard de l'universite; Address3: J1K2R SHERBROOKE; Address4: QUEBEC, CANADA
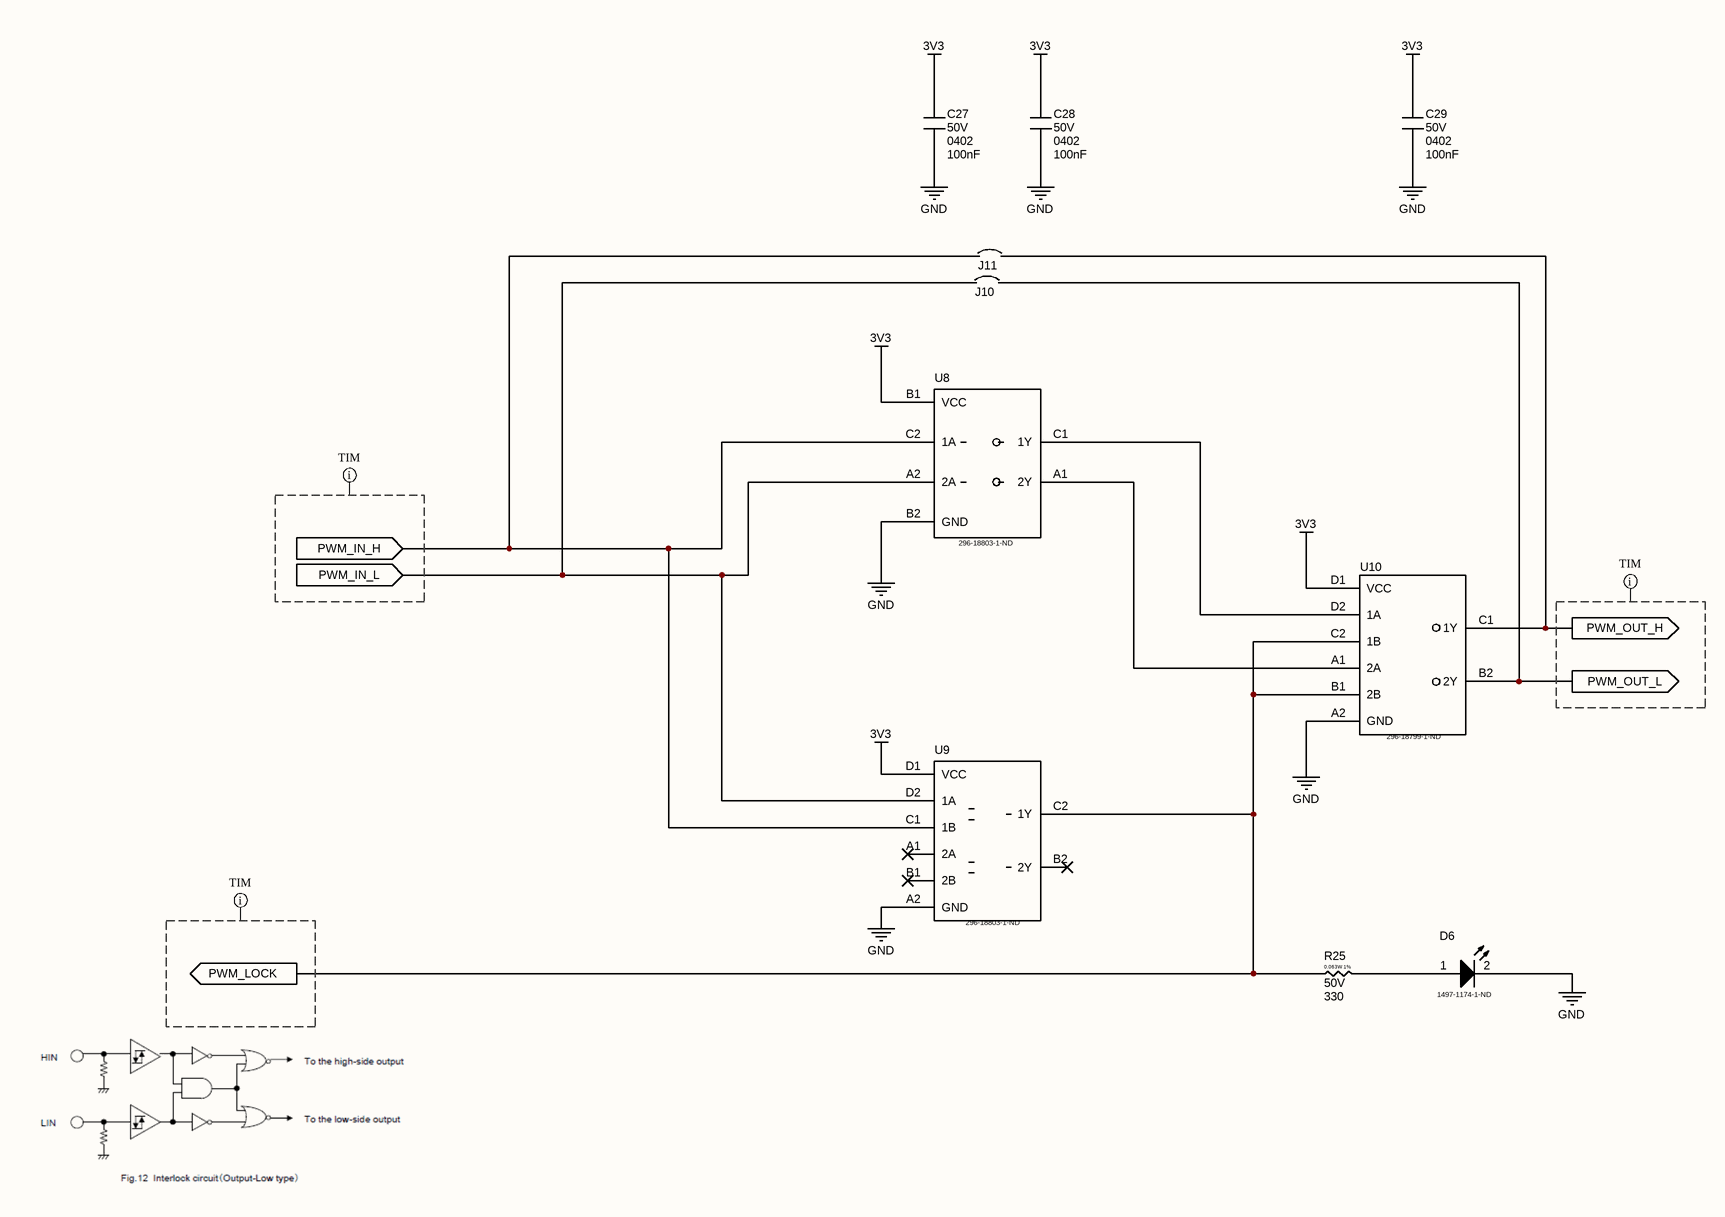
[diagram p9: 7-PWM_INTERLOCK.SchDoc]

### Parts
C27  VDC: 50V  Package: 0402  [C 0402(1005)x0.5]  (hidden comment: 100nF)
C28  VDC: 50V  Package: 0402  [C 0402(1005)x0.5]  (hidden comment: 100nF)
C29  VDC: 50V  Package: 0402  [C 0402(1005)x0.5]  (hidden comment: 100nF)
D6  Supplier Part Number 1: 1497-1174-1-ND  [LED 0402]  (hidden comment: 0402)
J10  SHORT_PARALLEL  [SHORT_PARALLEL]  (value not drawn)  (net tie, no BOM)
J11  SHORT_PARALLEL  [SHORT_PARALLEL]  (value not drawn)  (net tie, no BOM)
R25  VDC: 50V  [R 0402(1005)-1%]  (hidden comment: 330)
U8  Supplier Part Number 1: 296-18803-1-ND  [DSBGA-6]  (hidden comment: DSGBA6)
U9  Supplier Part Number 1: 296-18803-1-ND  [DSBGA-8]  (hidden comment: DSGBA8)
U10  Supplier Part Number 1: 296-18799-1-ND  [DSBGA-8]  (hidden comment: DSBGA8)

### Ports
PWM_IN_H (in), PWM_IN_L (in), PWM_LOCK (out), PWM_OUT_H (out), PWM_OUT_L (out)

### Nets
3V3: C27.1 C28.1 C29.1 U8.B1(VCC) U9.D1(VCC) U10.D1(VCC)
GND: C27.2 C28.2 C29.2 D6.2 U8.B2(GND) U9.A2(GND) U10.A2(GND)
NetD6_1: D6.1 R25.2
NetJ10_1: J10.1 U8.A2(2A) U9.D2(1A) ; port PWM_IN_L
NetJ10_2: J10.2 U10.B2(2Y) ; port PWM_OUT_L
NetJ11_1: J11.1 U8.C2(1A) U9.C1(1B) ; port PWM_IN_H
NetJ11_2: J11.2 U10.C1(1Y) ; port PWM_OUT_H
NetR25_1: R25.1 U9.C2(1Y) U10.B1(2B) U10.C2(1B) ; port PWM_LOCK
NetU8_A1: U8.A1(2Y) U10.A1(2A)
NetU8_C1: U8.C1(1Y) U10.D2(1A)

Not connected (* = marked no-connect by the designer): U9 A1(2A)* B1(2B)* B2(2Y)*

### Layout directives
net class TIM: (no net found under the mark)

### Notes on the sheet
- Size:
- Title:
- A
- Revision:
- Author:
- Date:
- File:
- Time:
- Sheet
- of
- (in symbol RES 0402-1%) 0.063W 1%

### Library data of the parts
C27-C29 = CAP 0402 100nF 50V X7R: as C5 on sheet 3-MCU; Mount Type: SMT; Publisher: Hefest; Manufacturer Alternate: *; Part Number Alternate: *; Published: 07.04.2019; Supplier 1: Comet; Supplier 2: *; Supplier 3: *; Supplier Part Number 1: C0402 100nF 50V X7R; Supplier Part Number 2: *; Supplier Part Number 3: *; RoHS: Y; Technology: Ceramic  MLCC; Value 1: *; Value 2: *; TempCo: X7R; Tolerance %: ±10%; VAC: *; ESR Ohm: *; ComponentLink1Description: Datasheet link; ComponentLink1URL: https://store.comet.bg/download-file.php?id=11; Temperature Range: -55°C ~ +125°C; Price: 0.039; Value: 100nF
D6 = LED 0402: LED SMD 0402; Supplier 1: Digi-Key; TYPE: LED; PACKAGE: 0402
J10 J11 = SHORT_PARALLEL: SHORTABLE PARALLEL PCB LINK
R25 = RES 0402-1%: as R1#1 on sheet 2-BUCK_3V3_MCU; Part Number: *; Mount Type: SMT; Publisher: Hefest; Manufacturer Alternate: *; Published: 07.04.2019; Supplier 1: Comet; Supplier 2: *; Supplier 3: *; Supplier Part Number 1: R0402 1.0K 1% YAG/ASJ; Supplier Part Number 2: *; Supplier Part Number 3: *; RoHS: Y; Technology: Thick film; Value 2: *; Package: 0402; Tolerance %: ±1%; ComponentLink1Description: Datasheet link; ComponentLink1URL: https://store.comet.bg/download-file.php?id=1224; Temperature Range: -55°C ~ +155°C; Price: 0.015; Part Number Alternate: *; TYPE: Resistor; Value 1: *; Value: 330
U8 = SN74LVC2G14_BGA: INV DUAL SCHMITT; TYPE: INV; PACKAGE 1: DSGBA6; Supplier 1: Digi-Key
U9 = SN74LVC2G08_BGA: AND DUAL SCHMITT; PACKAGE 1: DSBGA8; TYPE: AND; Supplier 1: Digi-Key
U10 = SN74LVC2G02_BGA: NOR DUAL; PACKAGE 1: DSBGA8; TYPE: NOR; Supplier 1: Digi-Key

## Sheet 8-DRV_LDO_6V.SchDoc: DRV LDO 6V
size A4; CompanyName: e-TESC LAB; Organization: Sherbrooke's University; Address1: Genie / GEGI; Address2: 2500 boulevard de l'universite; Address3: J1K2R SHERBROOKE; Address4: QUEBEC, CANADA; DocumentNumber: 3; SheetNumber: 3; SheetTotal: 7
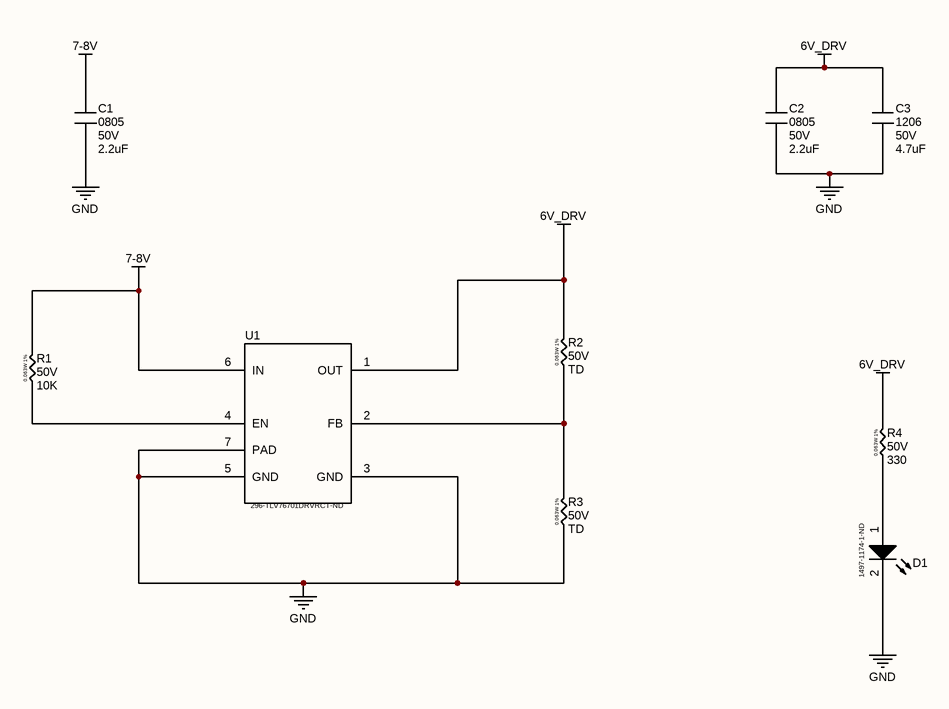
[diagram p10: 8-DRV_LDO_6V.SchDoc]

### Parts
(Parts that share a designator on the sheet are numbered #1, #2 ... from top to bottom, then left to right.)
C1#2  Package: 0805  VDC: 50V  [C 0805(2012)x0.65]  (hidden comment: 2.2uF)
C2#2  Package: 0805  VDC: 50V  [C 0805(2012)x0.65]  (hidden comment: 2.2uF)
C3  Package: 1206  VDC: 50V  [C 1206(3216)x1.6]  (hidden comment: 4.7uF)
D1#2  Supplier Part Number 1: 1497-1174-1-ND  [LED 0402]  (hidden comment: 0402)
R1#2  VDC: 50V  [R 0402(1005)-1%]  (hidden comment: 10K)
R2#2  VDC: 50V  [R 0402(1005)-1%]  (hidden comment: TD)
R3#2  VDC: 50V  [R 0402(1005)-1%]  (hidden comment: TD)
R4#2  VDC: 50V  [R 0402(1005)-1%]  (hidden comment: 330)
U1#2  Supplier Part Number 1: 296-TLV76701DRVRCT-ND  [WSON-6_0.65_EP]  (hidden comment: WSON6_EP)

### Nets
6V_DRV: C2#2.1 C3.1 R2#2.2 R4#2.2 U1#2.1(OUT)
7-8V: C1#2.1 R1#2.2 U1#2.6(IN)
GND: C1#2.2 C2#2.2 C3.2 D1#2.2 R3#2.1 U1#2.3(GND) U1#2.5(GND) U1#2.7(PAD)
NetD1#2_1: D1#2.1 R4#2.1
NetR1#2_1: R1#2.1 U1#2.4(EN)
NetR2#2_1: R2#2.1 R3#2.2 U1#2.2(FB)

### Notes on the sheet
- Title:
- Size:
- Date:
- A
- Revision:
- Time:
- Author:
- Sheet
- of
- File:
- (in symbol RES 0402-1%) 0.063W 1%

### Library data of the parts
C1#2 C2#2 = CAP 0805 2.2nF 50V X7R: as C1#1 on sheet 2-BUCK_3V3_MCU; Mount Type: SMT; Publisher: Hefest; Manufacturer Alternate: *; Part Number Alternate: *; Published: 07.04.2019; Supplier 1: Comet; Supplier 2: *; Supplier 3: *; Supplier Part Number 1: C0805 2.2nF 50V X7R SAMSUNG; Supplier Part Number 2: *; Supplier Part Number 3: *; RoHS: Y; Technology: Ceramic  MLCC; Value 1: *; Value 2: *; TempCo: X7R; Tolerance %: ±10%; VAC: *; ESR Ohm: *; ComponentLink1Description: Datasheet link; ComponentLink1URL: https://store.comet.bg/download-file.php?id=11; Temperature Range: -55°C ~ +125°C; Price: 0.026; Value: 2.2uF
C3 = CAP 1206 4.7uF 50V X7R: as C?#2 on sheet 2-BUCK_3V3_MCU; Mount Type: SMT; Publisher: Hefest; Manufacturer Alternate: *; Part Number Alternate: *; Published: 07.04.2019; Supplier 1: Comet; Supplier 2: *; Supplier 3: *; Supplier Part Number 1: C1206 4.7uF 50V X7R SAMSUNG; Supplier Part Number 2: *; Supplier Part Number 3: *; RoHS: Y; Technology: Ceramic  MLCC; Value 1: *; Value 2: *; TempCo: X7R; Tolerance %: ±10%; VAC: *; ESR Ohm: *; ComponentLink1Description: Datasheet link; ComponentLink1URL: https://store.comet.bg/download-file.php?id=11; Temperature Range: -55°C ~ +125°C; Price: 0.290; Value: 4.7uF
D1#2 = LED 0402: LED SMD 0402; Supplier 1: Digi-Key; PACKAGE: 0402; TYPE: LED
R1#2 R2#2 R3#2 R4#2 = RES 0402-1%: as R1#1 on sheet 2-BUCK_3V3_MCU; Part Number: *; Mount Type: SMT; Publisher: Hefest; Manufacturer Alternate: *; Published: 07.04.2019; Supplier 1: Comet; Supplier 2: *; Supplier 3: *; Supplier Part Number 1: R0402 1.0K 1% YAG/ASJ; Supplier Part Number 2: *; Supplier Part Number 3: *; RoHS: Y; Technology: Thick film; Value 2: *; Package: 0402; Tolerance %: ±1%; ComponentLink1Description: Datasheet link; ComponentLink1URL: https://store.comet.bg/download-file.php?id=1224; Temperature Range: -55°C ~ +155°C; Price: 0.015; Part Number Alternate: *; TYPE: Resistor; Value 1: *
  R1#2: Value: 10K
  R2#2 R3#2: Value: TD
  R4#2: Value: 330
U1#2 = TLV76701: LDO ADJ; Supplier 1: Digi-Key

## Sheet 9-SIGNAL_CONDITIONING.SchDoc: SIGNAL CONDITOINING
size A4; Author: Alexandre Cosneau; CompanyName: Tristar Multicopters; DrawnBy: Alexandre Cosneau; Engineer: Alexandre Cosneau; Organization: Tristar Multicopters; Address1: Genie / GEGI; Address2: 2500 boulevard de l'universite; Address3: J1K2R SHERBROOKE; Address4: QUEBEC, CANADA; DocumentNumber: 15; Revision: 1.0; SheetNumber: 15; SheetTotal: 15
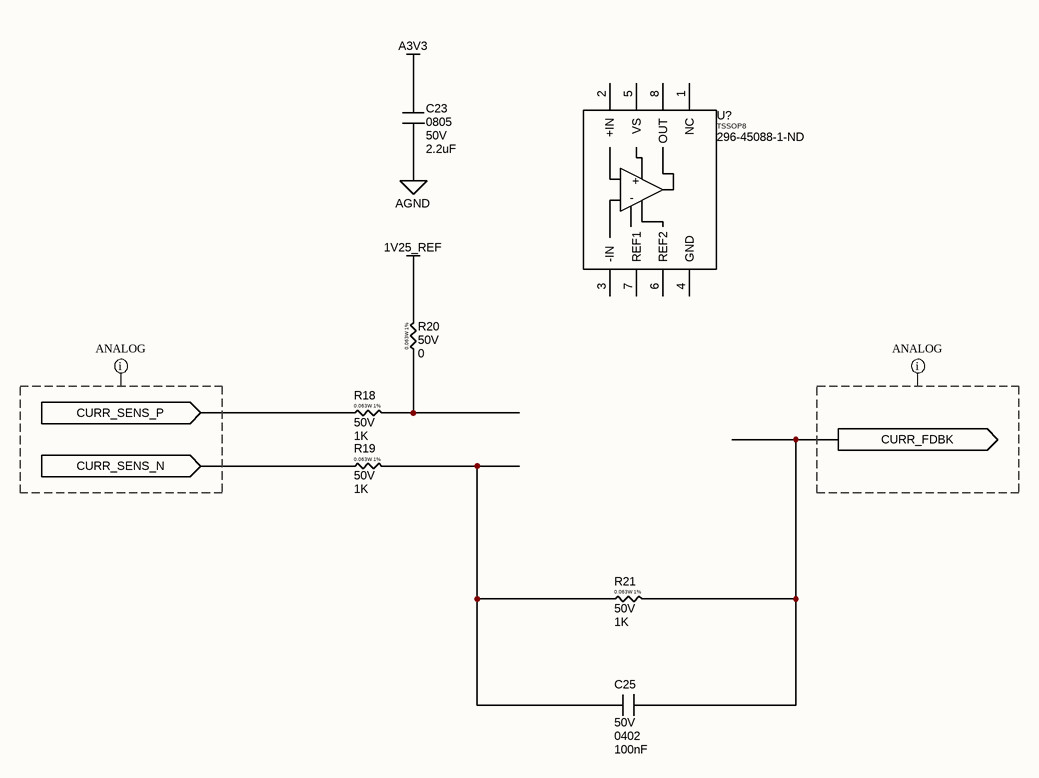
[diagram p11: 9-SIGNAL_CONDITIONING.SchDoc]

### Parts
(Parts that share a designator on the sheet are numbered #1, #2 ... from top to bottom, then left to right.)
C23#2  Package: 0805  VDC: 50V  [C 0805(2012)x0.65]  (hidden comment: 2.2uF)
C25#2  VDC: 50V  Package: 0402  [C 0402(1005)x0.5]  (hidden comment: 100nF)
R18#2  VDC: 50V  [R 0402(1005)-1%]  (hidden comment: 1K)
R19#2  VDC: 50V  [R 0402(1005)-1%]  (hidden comment: 1K)
R20#2  VDC: 50V  [R 0402(1005)-1%]  (hidden comment: 0)
R21#2  VDC: 50V  [R 0402(1005)-1%]  (hidden comment: 1K)
U?#2  TSSOP8  Supplier Part Number 1: 296-45088-1-ND  [TSSOP_8_4.4]

### Ports
CURR_FDBK (out), CURR_SENS_N (in), CURR_SENS_P (in)

### Nets
1V25_REF: R20#2.2
A3V3: C23#2.1
AGND: C23#2.2
NetC25#2_1: C25#2.1 R19#2.2 R21#2.1
NetC25#2_2: C25#2.2 R21#2.2 ; port CURR_FDBK
NetR18#2_1: R18#2.1 ; port CURR_SENS_P
NetR18#2_2: R18#2.2 R20#2.1
NetR19#2_1: R19#2.1 ; port CURR_SENS_N

Not connected (* = marked no-connect by the designer): U?#2 1(NC) 2(+IN) 3(-IN) 4(GND) 5(VS) 6(REF2) 7(REF1) 8(OUT)

### Layout directives
net class ANALOG: (no net found under the mark)

### Notes on the sheet
- Title:
- Size:
- Date:
- E
- Revision:
- Time:
- Author:
- Sheet
- of
- File:
- (in symbol INA240-Q1) +; -
- (in symbol RES 0402-1%) 0.063W 1%

### Library data of the parts
C23#2 = CAP 0805 2.2nF 50V X7R: as C1#1 on sheet 2-BUCK_3V3_MCU; Mount Type: SMT; Publisher: Hefest; Manufacturer Alternate: *; Part Number Alternate: *; Published: 07.04.2019; Supplier 1: Comet; Supplier 2: *; Supplier 3: *; Supplier Part Number 1: C0805 2.2nF 50V X7R SAMSUNG; Supplier Part Number 2: *; Supplier Part Number 3: *; RoHS: Y; Technology: Ceramic  MLCC; Value 1: *; Value 2: *; TempCo: X7R; Tolerance %: ±10%; VAC: *; ESR Ohm: *; ComponentLink1Description: Datasheet link; ComponentLink1URL: https://store.comet.bg/download-file.php?id=11; Temperature Range: -55°C ~ +125°C; Price: 0.026; Value: 2.2uF
C25#2 = CAP 0402 100nF 50V X7R: as C5 on sheet 3-MCU; Mount Type: SMT; Publisher: Hefest; Manufacturer Alternate: *; Part Number Alternate: *; Published: 07.04.2019; Supplier 1: Comet; Supplier 2: *; Supplier 3: *; Supplier Part Number 1: C0402 100nF 50V X7R; Supplier Part Number 2: *; Supplier Part Number 3: *; RoHS: Y; Technology: Ceramic  MLCC; Value 1: *; Value 2: *; TempCo: X7R; Tolerance %: ±10%; VAC: *; ESR Ohm: *; ComponentLink1Description: Datasheet link; ComponentLink1URL: https://store.comet.bg/download-file.php?id=11; Temperature Range: -55°C ~ +125°C; Price: 0.039; Value: 100nF
R18#2 R19#2 R20#2 R21#2 = RES 0402-1%: as R1#1 on sheet 2-BUCK_3V3_MCU; Part Number: *; Mount Type: SMT; Publisher: Hefest; Manufacturer Alternate: *; Published: 07.04.2019; Supplier 1: Comet; Supplier 2: *; Supplier 3: *; Supplier Part Number 1: R0402 1.0K 1% YAG/ASJ; Supplier Part Number 2: *; Supplier Part Number 3: *; RoHS: Y; Technology: Thick film; Value 2: *; Package: 0402; Tolerance %: ±1%; ComponentLink1Description: Datasheet link; ComponentLink1URL: https://store.comet.bg/download-file.php?id=1224; Temperature Range: -55°C ~ +155°C; Price: 0.015; Part Number Alternate: *; TYPE: Resistor; Value 1: *
  R18#2 R19#2 R21#2: Value: 1K
  R20#2: Value: 0
U?#2 = INA240-Q1: Current-Sense Amp., Zero-Drift, Wide Common-Mode, PWM Rej.; Supplier 1: Digi-Key

## Sheet 10-BUS_SENS.SchDoc: TEMPERATURE
size A4; Author: Alexandre Cosneau; CompanyName: Tristar Multicopters; DrawnBy: Alexandre Cosneau; Engineer: Alexandre Cosneau; Organization: Tristar Multicopters; Address1: Genie / GEGI; Address2: 2500 boulevard de l'universite; Address3: J1K2R SHERBROOKE; Address4: QUEBEC, CANADA; DocumentNumber: 5; Revision: 1.0; SheetNumber: 5; SheetTotal: 7
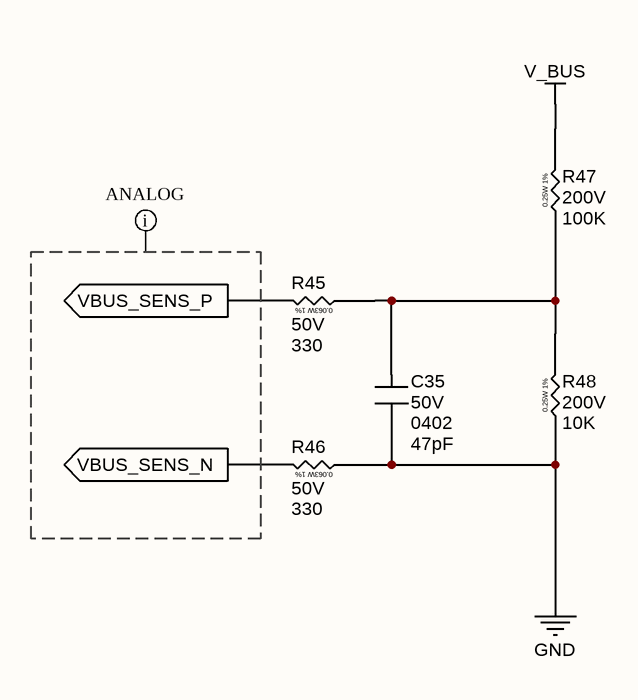
[diagram p12: 10-BUS_SENS.SchDoc]

### Parts
C35  VDC: 50V  Package: 0402  [C 0402(1005)x0.5]  (hidden comment: 47pF)
R45  VDC: 50V  [R 0402(1005)-1%]  (hidden comment: 330)
R46  VDC: 50V  [R 0402(1005)-1%]  (hidden comment: 330)
R47  VDC: 200V  [R 1210(3225)-1%]  (hidden comment: 100K)
R48  VDC: 200V  [R 1210(3225)-1%]  (hidden comment: 10K)

### Ports
VBUS_SENS_N (out), VBUS_SENS_P (out)

### Nets
GND: C35.2 R46.1 R48.1
V_BUS: R47.2
NetC35_1: C35.1 R45.1 R47.1 R48.2
NetR45_2: R45.2 ; port VBUS_SENS_P
NetR46_2: R46.2 ; port VBUS_SENS_N

### Layout directives
net class ANALOG: (no net found under the mark)

### Notes on the sheet
- Title:
- Size:
- Date:
- A
- Revision:
- Time:
- Author:
- Sheet
- of
- File:
- (in symbol RES 0402-1%) 0.063W 1%
- (in symbol RES 1206-1%) 0.25W 1%

### Library data of the parts
C35 = CAP 0402 100nF 50V X7R: as C5 on sheet 3-MCU; Mount Type: SMT; Publisher: Hefest; Manufacturer Alternate: *; Part Number Alternate: *; Published: 07.04.2019; Supplier 1: Comet; Supplier 2: *; Supplier 3: *; Supplier Part Number 1: C0402 100nF 50V X7R; Supplier Part Number 2: *; Supplier Part Number 3: *; RoHS: Y; Technology: Ceramic  MLCC; Value 1: *; Value 2: *; TempCo: X7R; Tolerance %: ±10%; VAC: *; ESR Ohm: *; ComponentLink1Description: Datasheet link; ComponentLink1URL: https://store.comet.bg/download-file.php?id=11; Temperature Range: -55°C ~ +125°C; Price: 0.039; Value: 47pF
R45 R46 = RES 0402-1%: as R1#1 on sheet 2-BUCK_3V3_MCU; Part Number: *; Mount Type: SMT; Publisher: Hefest; Manufacturer Alternate: *; Published: 07.04.2019; Supplier 1: Comet; Supplier 2: *; Supplier 3: *; Supplier Part Number 1: R0402 1.0K 1% YAG/ASJ; Supplier Part Number 2: *; Supplier Part Number 3: *; RoHS: Y; Technology: Thick film; Value 2: *; Package: 0402; Tolerance %: ±1%; ComponentLink1Description: Datasheet link; ComponentLink1URL: https://store.comet.bg/download-file.php?id=1224; Temperature Range: -55°C ~ +155°C; Price: 0.015; Part Number Alternate: *; TYPE: Resistor; Value 1: *; Value: 330
R47 R48 = RES 1206-1%: SMD 1206 0.25W  1% 200V; Manufacturer: YAGEO; TempCo: ±100ppm/°C; Package-mm: 3216; Value Code: 1001; Part Number: *; Mount Type: SMT; Publisher: Hefest; Manufacturer Alternate: *; Published: 07.04.2019; Supplier 1: Comet; Supplier 2: *; Supplier 3: *; Supplier Part Number 1: R1206 1.0K 1% YAG/ASJ; Supplier Part Number 2: *; Supplier Part Number 3: *; RoHS: Y; Technology: Thick film; Value 2: *; Package: 1206; Tolerance %: ±1%; ComponentLink1Description: Datasheet link; ComponentLink1URL: https://store.comet.bg/download-file.php?id=1224; Temperature Range: -55°C ~ +155°C; Price: 0.069; Part Number Alternate: *; TYPE: Resistor; Value 1: *; Power: 0.25W
  R47: Value: 100K
  R48: Value: 10K

## Sheet 11-HALF_BRIDGE.SchDoc: INVERTER
size A3; Author: Alexandre Cosneau; CompanyName: Tristar Multicopters; DrawnBy: Alexandre Cosneau; Engineer: Alexandre Cosneau; Organization: Tristar Multicopters; Address1: Genie / GEGI; Address2: 2500 boulevard de l'universite; Address3: J1K2R SHERBROOKE; Address4: QUEBEC, CANADA; DocumentNumber: 4; Revision: 1.0; SheetNumber: 4; SheetTotal: 7
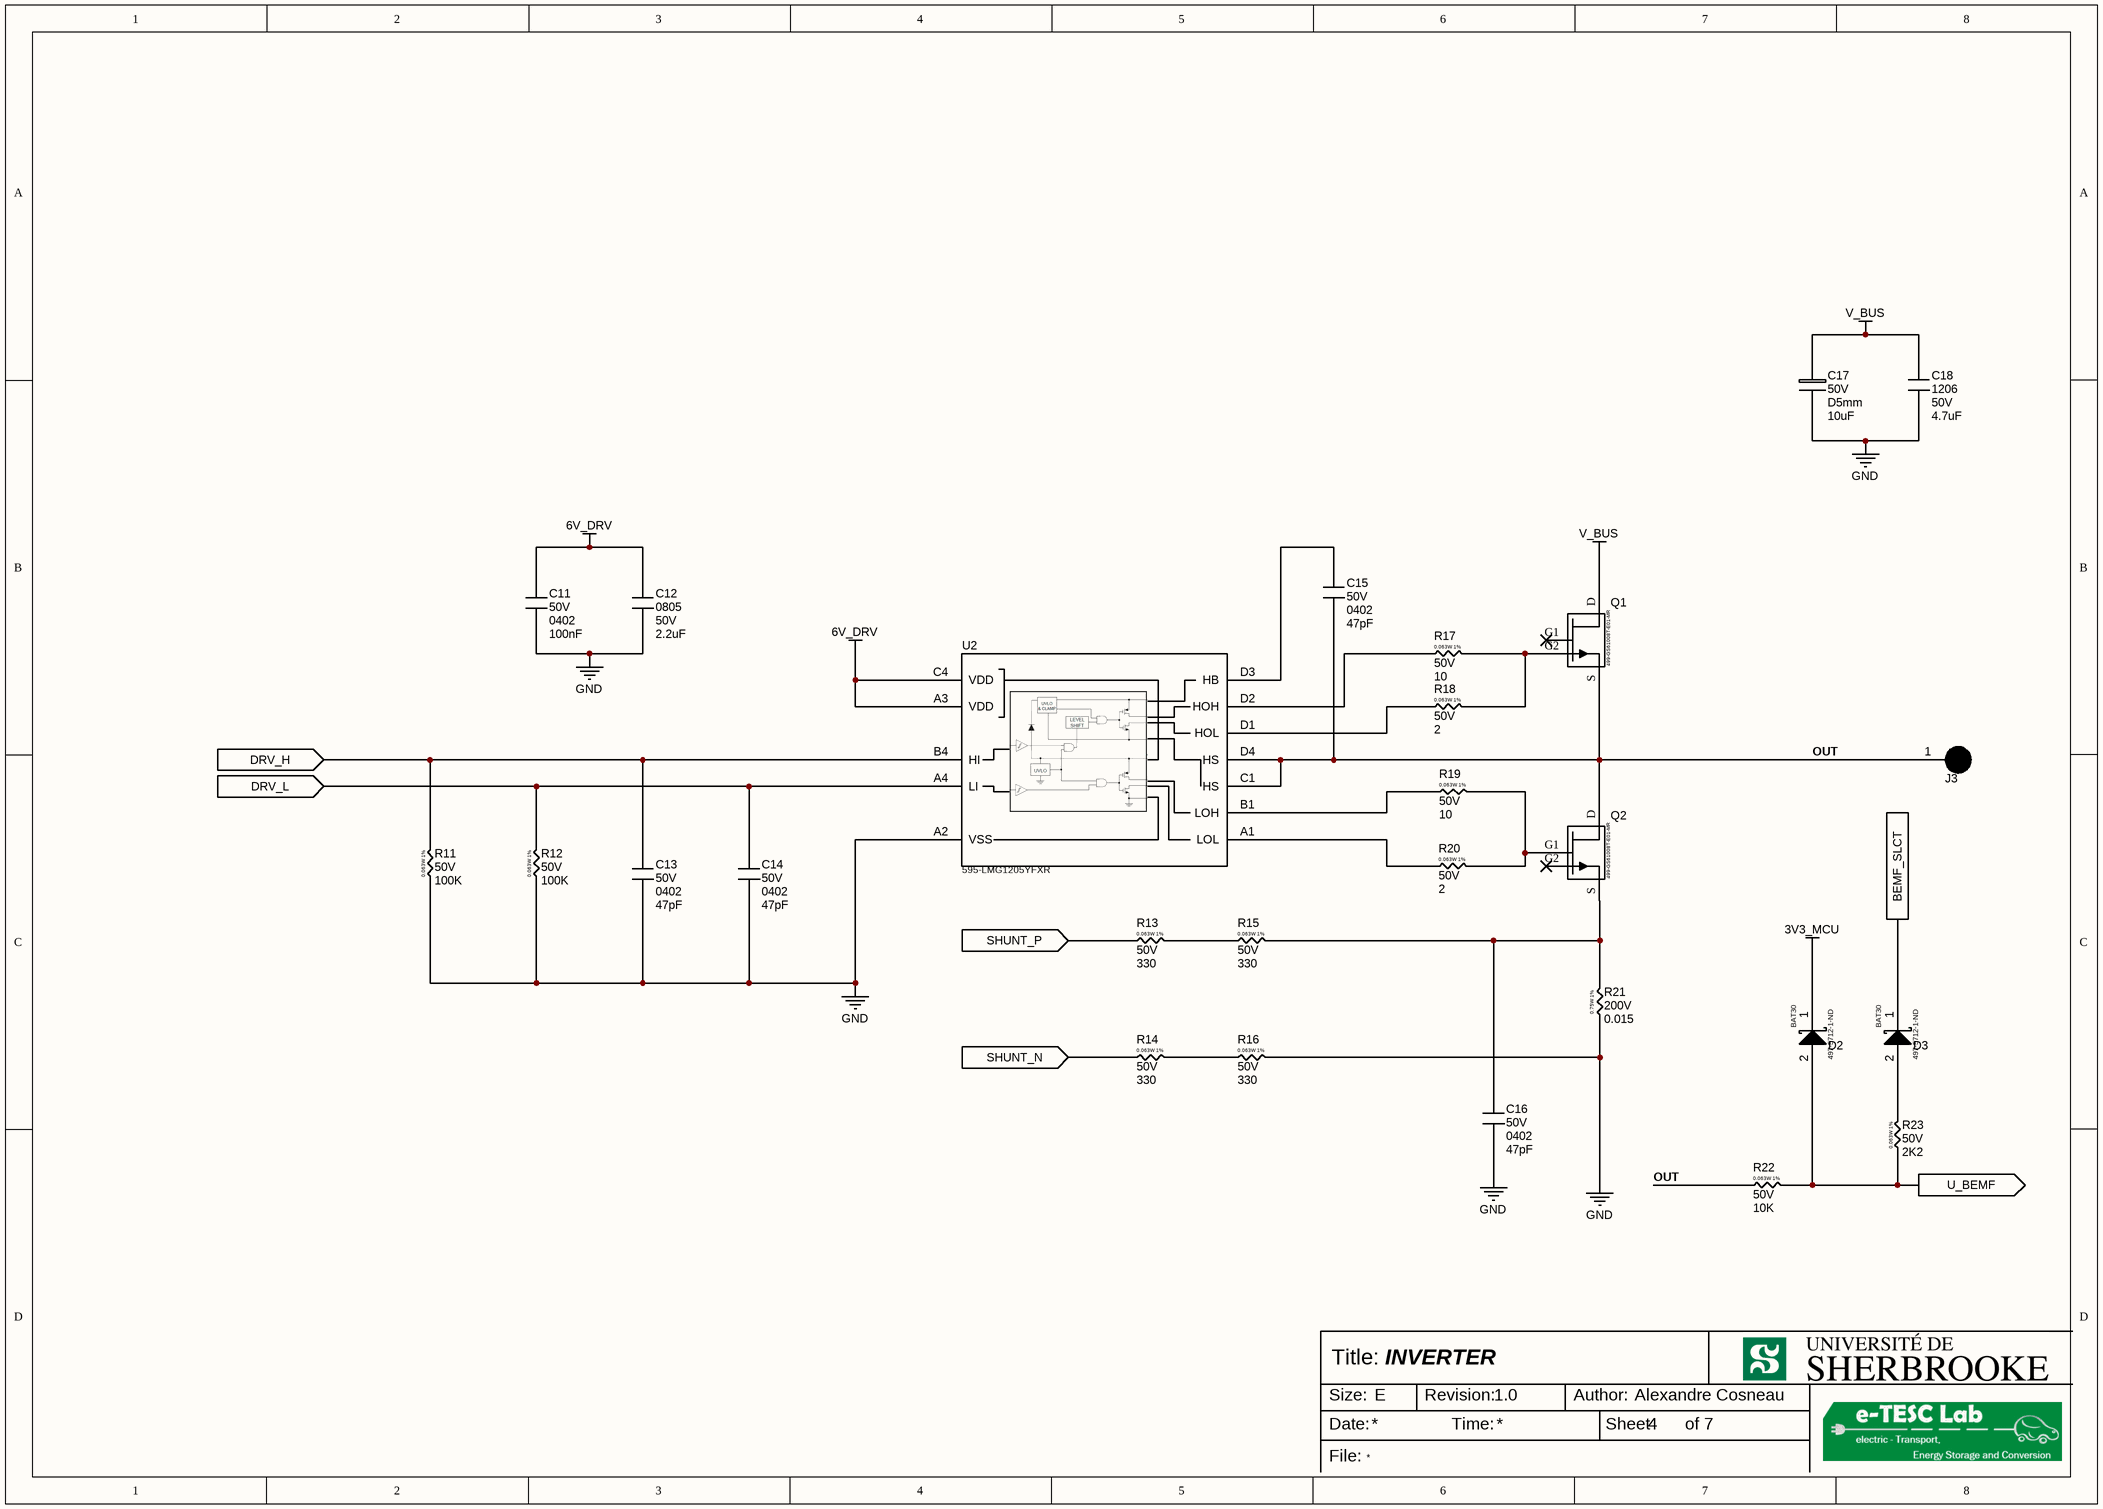
[diagram p13: 11-HALF_BRIDGE.SchDoc]

### Parts
(Parts that share a designator on the sheet are numbered #1, #2 ... from top to bottom, then left to right.)
C11#2  VDC: 50V  Package: 0402  [C 0402(1005)x0.5]  (hidden comment: 100nF)
C12#2  Package: 0805  VDC: 50V  [C 0805(2012)x0.65]  (hidden comment: 2.2uF)
C13#2  VDC: 50V  Package: 0402  [C 0402(1005)x0.5]  (hidden comment: 47pF)
C14#2  VDC: 50V  Package: 0402  [C 0402(1005)x0.5]  (hidden comment: 47pF)
C15#2  VDC: 50V  Package: 0402  [C 0402(1005)x0.5]  (hidden comment: 47pF)
C16#2  VDC: 50V  Package: 0402  [C 0402(1005)x0.5]  (hidden comment: 47pF)
C17#2  VDC: 50V  Package: D5mm  [EL SMD D5 h5.4]  (hidden comment: 10uF)
C18#2  Package: 1206  VDC: 50V  [C 1206(3216)x1.6]  (hidden comment: 4.7uF)
D2#2  Supplier Part Number 1: 497-5712-1-ND  [SOD-523]  (hidden comment: SOD523)
D3#2  Supplier Part Number 1: 497-5712-1-ND  [SOD-523]  (hidden comment: SOD523)
J3  PAD_3_RD  [PAD_03-03-RD]  (value not drawn)  (net tie, no BOM)
Q1#2  Supplier Part Number 1: 499-GS61008T-E01-MR  [GS61008T]  (hidden comment: GS61008T)
Q2  Supplier Part Number 1: 499-GS61008T-E01-MR  [GS61008T]  (hidden comment: GS61008T)
R11#2  VDC: 50V  [R 0402(1005)-1%]  (hidden comment: 100K)
R12#2  VDC: 50V  [R 0402(1005)-1%]  (hidden comment: 100K)
R13#2  VDC: 50V  [R 0402(1005)-1%]  (hidden comment: 330)
R14#2  VDC: 50V  [R 0402(1005)-1%]  (hidden comment: 330)
R15#2  VDC: 50V  [R 0402(1005)-1%]  (hidden comment: 330)
R16#2  VDC: 50V  [R 0402(1005)-1%]  (hidden comment: 330)
R17#2  VDC: 50V  [R 0402(1005)-1%]  (hidden comment: 10)
R18#3  VDC: 50V  [R 0402(1005)-1%]  (hidden comment: 2)
R19#3  VDC: 50V  [R 0402(1005)-1%]  (hidden comment: 10)
R20#3  VDC: 50V  [R 0402(1005)-1%]  (hidden comment: 2)
R21#3  VDC: 200V  [R 2010(5025)-1%]  (hidden comment: 0.015)
R22#2  VDC: 50V  [R 0402(1005)-1%]  (hidden comment: 10K)
R23  VDC: 50V  [R 0402(1005)-1%]  (hidden comment: 2K2)
U2#2  Supplier Part Number 2: 595-LMG1205YFXR  [DSBGA-12]  (hidden comment: LMG1205)

### Ports
BEMF_SLCT, DRV_H (in), DRV_L (in), SHUNT_N (in), SHUNT_P (in), U_BEMF (out)

### Nets
3V3_MCU: D2#2.1
6V_DRV: C11#2.1 C12#2.1 U2#2.A3(VDD) U2#2.C4(VDD)
GND: C11#2.2 C12#2.2 C13#2.2 C14#2.2 C16#2.2 C17#2.2 C18#2.2 R11#2.1 R12#2.1 R16#2.2 R21#3.1 U2#2.A2(VSS)
V_BUS: C17#2.1 C18#2.1 Q1#2.D
OUT: C15#2.2 J3.1 Q1#2.S Q2.D R22#2.1 U2#2.C1(HS) U2#2.D4(HS)
TIM2_CH1: D3#2.1 ; port BEMF_SLCT
NetC13#2_1: C13#2.1 R11#2.2 U2#2.B4(HI) ; port DRV_H
NetC14#2_1: C14#2.1 R12#2.2 U2#2.A4(LI) ; port DRV_L
NetC15#2_1: C15#2.1 U2#2.D3(HB)
NetC16#2_1: C16#2.1 Q2.S R15#2.2 R21#3.2
NetD2#2_2: D2#2.2 R22#2.2 R23.1 ; port U_BEMF
NetD3#2_2: D3#2.2 R23.2
NetQ1#2_G2: Q1#2.G2 R17#2.2 R18#3.2
NetQ2_G1: Q2.G1 R19#3.2 R20#3.2
NetR13#2_1: R13#2.1 ; port SHUNT_P
NetR13#2_2: R13#2.2 R15#2.1
NetR14#2_1: R14#2.1 ; port SHUNT_N
NetR14#2_2: R14#2.2 R16#2.1
NetR17#2_1: R17#2.1 U2#2.D2(HOH)
NetR18#3_1: R18#3.1 U2#2.D1(HOL)
NetR19#3_1: R19#3.1 U2#2.B1(LOH)
NetR20#3_1: R20#3.1 U2#2.A1(LOL)

Not connected (* = marked no-connect by the designer): Q1#2 G1*; Q2 G2*

### Notes on the sheet
- Title:
- Size:
- Date:
- File:
- E
- Revision:
- Time:
- Author:
- Sheet
- of
- (in symbol RES 0402-1%) 0.063W 1%
- (in symbol RES 2010-1%) 0.75W 1%

### Library data of the parts
C11#2 C13#2 C14#2 C15#2 C16#2 = CAP 0402 100nF 50V X7R: as C5 on sheet 3-MCU; Mount Type: SMT; Publisher: Hefest; Manufacturer Alternate: *; Part Number Alternate: *; Published: 07.04.2019; Supplier 1: Comet; Supplier 2: *; Supplier 3: *; Supplier Part Number 1: C0402 100nF 50V X7R; Supplier Part Number 2: *; Supplier Part Number 3: *; RoHS: Y; Technology: Ceramic  MLCC; Value 1: *; Value 2: *; TempCo: X7R; Tolerance %: ±10%; VAC: *; ESR Ohm: *; ComponentLink1Description: Datasheet link; ComponentLink1URL: https://store.comet.bg/download-file.php?id=11; Temperature Range: -55°C ~ +125°C; Price: 0.039
  C11#2: Value: 100nF
  C13#2 C14#2 C15#2 C16#2: Value: 47pF
C12#2 = CAP 0805 2.2nF 50V X7R: as C1#1 on sheet 2-BUCK_3V3_MCU; Mount Type: SMT; Publisher: Hefest; Manufacturer Alternate: *; Part Number Alternate: *; Published: 07.04.2019; Supplier 1: Comet; Supplier 2: *; Supplier 3: *; Supplier Part Number 1: C0805 2.2nF 50V X7R SAMSUNG; Supplier Part Number 2: *; Supplier Part Number 3: *; RoHS: Y; Technology: Ceramic  MLCC; Value 1: *; Value 2: *; TempCo: X7R; Tolerance %: ±10%; VAC: *; ESR Ohm: *; ComponentLink1Description: Datasheet link; ComponentLink1URL: https://store.comet.bg/download-file.php?id=11; Temperature Range: -55°C ~ +125°C; Price: 0.026; Value: 2.2uF
C17#2 = EL 10uF 50V +105°C: as C2#1 on sheet 2-BUCK_3V3_MCU; Mount Type: SMT; Publisher: Hefest; Manufacturer Alternate: *; Part Number Alternate: *; Published: 07.04.2019; Supplier 1: Comet; Supplier 2: *; Supplier 3: *; Supplier Part Number 1: CE 10uF 50V SMD 105C Fujicon; Supplier Part Number 2: *; Supplier Part Number 3: *; RoHS: Y; Technology: Electrolytic Aluminum; Value 1: *; Value 2: *; TempCo: *; VAC: *; ESR Ohm: *; ComponentLink1Description: Datasheet link; ComponentLink1URL: https://store.comet.bg/download-file.php?id=10100; Temperature Range: -40°C ~ +105°C; Price: 0.106; Value: 10uF
C18#2 = CAP 1206 4.7uF 50V X7R: as C?#2 on sheet 2-BUCK_3V3_MCU; Mount Type: SMT; Publisher: Hefest; Manufacturer Alternate: *; Part Number Alternate: *; Published: 07.04.2019; Supplier 1: Comet; Supplier 2: *; Supplier 3: *; Supplier Part Number 1: C1206 4.7uF 50V X7R SAMSUNG; Supplier Part Number 2: *; Supplier Part Number 3: *; RoHS: Y; Technology: Ceramic  MLCC; Value 1: *; Value 2: *; TempCo: X7R; Tolerance %: ±10%; VAC: *; ESR Ohm: *; ComponentLink1Description: Datasheet link; ComponentLink1URL: https://store.comet.bg/download-file.php?id=11; Temperature Range: -55°C ~ +125°C; Price: 0.290; Value: 4.7uF
D2#2 D3#2 = BAT30: SCHOTTKY 30V 300mA; Supplier 1: Digi-Key; PACKAGE: SOD523; TYPE: BAT30
J3 = PAD_3_RD: ROUND 3X3 PAD FOR TERMINATION
Q1#2 Q2 = GS61008T: GAN TRANS E-MODE 100V 90A TOP SIDE COOL; Supplier 1: Mouser
R11#2 R12#2 R13#2 R14#2 R15#2 R16#2 R17#2 R18#3 R19#3 R20#3 R22#2 R23 = RES 0402-1%: as R1#1 on sheet 2-BUCK_3V3_MCU; Part Number: *; Mount Type: SMT; Publisher: Hefest; Manufacturer Alternate: *; Published: 07.04.2019; Supplier 1: Comet; Supplier 2: *; Supplier 3: *; Supplier Part Number 1: R0402 1.0K 1% YAG/ASJ; Supplier Part Number 2: *; Supplier Part Number 3: *; RoHS: Y; Technology: Thick film; Value 2: *; Package: 0402; Tolerance %: ±1%; ComponentLink1Description: Datasheet link; ComponentLink1URL: https://store.comet.bg/download-file.php?id=1224; Temperature Range: -55°C ~ +155°C; Price: 0.015; Part Number Alternate: *; TYPE: Resistor; Value 1: *
  R11#2 R12#2: Value: 100K
  R13#2 R14#2 R15#2 R16#2: Value: 330
  R17#2 R19#3: Value: 10
  R18#3 R20#3: Value: 2
  R22#2: Value: 10K
  R23: Value: 2K2
R21#3 = RES 2010-1%: SMD 2010 0.75W  1% 200V; Manufacturer: YAGEO; TempCo: ±100ppm/°C; Package-mm: 5025; Value Code: 1001; Part Number: *; Mount Type: SMT; Publisher: Hefest; Manufacturer Alternate: *; Published: 07.04.2019; Supplier 1: Comet; Supplier 2: *; Supplier 3: *; Supplier Part Number 1: R2010 1.0K 1% YAG/ASJ; Supplier Part Number 2: *; Supplier Part Number 3: *; RoHS: Y; Technology: Thick film; Value 2: *; Package: 2010; Tolerance %: ±1%; ComponentLink1Description: Datasheet link; ComponentLink1URL: https://store.comet.bg/download-file.php?id=1224; Temperature Range: -55°C ~ +155°C; Price: 0.104; Part Number Alternate: *; TYPE: Resistor; Value 1: *; Power: 0.75W; Value: 0.015
U2#2 = LMG1205: GaN DRIVER 80V 1MHz; Supplier 1: Digi-Key; Supplier 2: Mouser